# Altium project S7CAS-PLEIADES-CARTE-MERE_P20.PrjPcb (part 3 of 5)

## Sheet S7CAS-PLEIADES-CARTE-MERE_P20_Ethernet.SchDoc
size Tabloid; DocumentNumber: 2; SheetNumber: 12; SheetTotal: 20; Sheet_Name: Ethernet; Size: 11x17
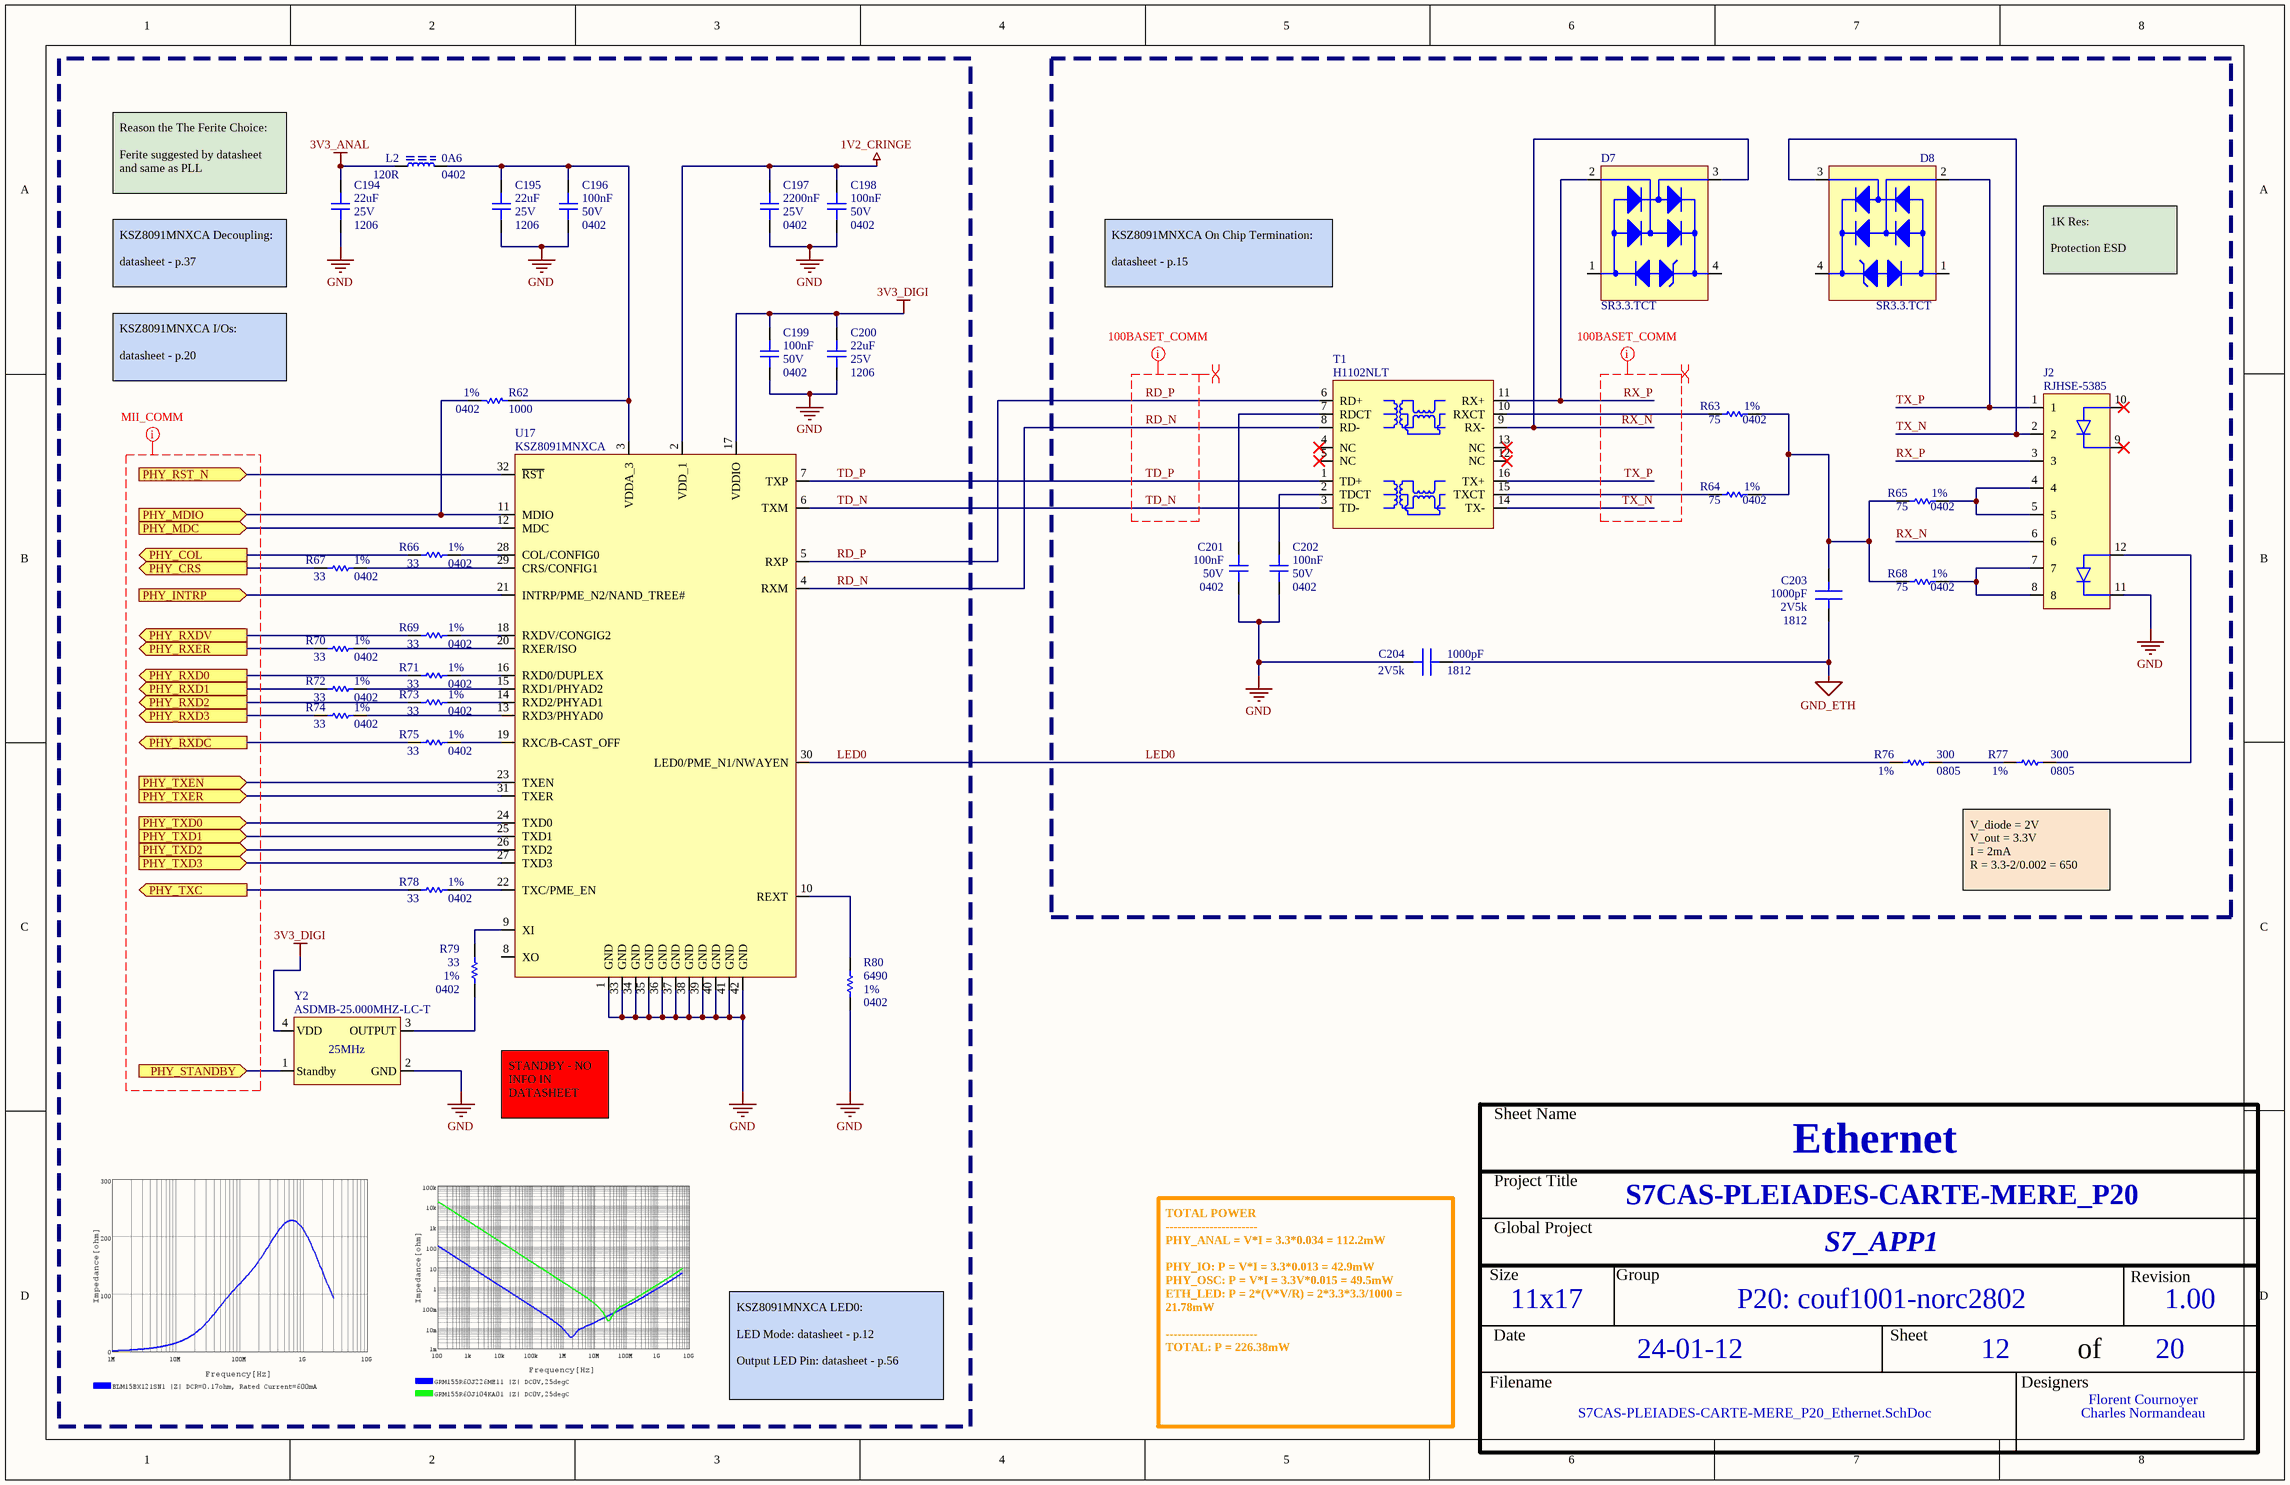
[diagram p11: S7CAS-PLEIADES-CARTE-MERE_P20_Ethernet.SchDoc]

### Parts
C194  value 22uF  Voltage: 25V  Package: 1206  [CAP_1206]  (hidden comment: CAP - 1206)
C195  value 22uF  Voltage: 25V  Package: 1206  [CAP_1206]  (hidden comment: CAP - 1206)
C196  value 100nF  Voltage: 50V  Package: 0402  [CAP_0402]  (hidden comment: CAP - 0402)
C197  value 2200nF  Voltage: 25V  Package: 0402  [CAP_0402]  (hidden comment: CAP - 0402)
C198  value 100nF  Voltage: 50V  Package: 0402  [CAP_0402]  (hidden comment: CAP - 0402)
C199  value 100nF  Voltage: 50V  Package: 0402  [CAP_0402]  (hidden comment: CAP - 0402)
C200  value 22uF  Voltage: 25V  Package: 1206  [CAP_1206]  (hidden comment: CAP - 1206)
C201  value 100nF  Voltage: 50V  Package: 0402  [CAP_0402]  (hidden comment: CAP - 0402)
C202  value 100nF  Voltage: 50V  Package: 0402  [CAP_0402]  (hidden comment: CAP - 0402)
C203  value 1000pF  Package: 1812  Voltage Rating: 2V5k  [CAP_CER_1812]  (hidden comment: 1812WC102KAT1A)
C204  value 1000pF  Package: 1812  Voltage Rating: 2V5k  [CAP_CER_1812]  (hidden comment: 1812WC102KAT1A)
D7  SR3.3.TCT  [TVS_SR3.3.TCT]
D8  SR3.3.TCT  [TVS_SR3.3.TCT]
J2  RJHSE-5385  [CONN_ETHERNET_RJHSE-5385]
L2  value 120R  Current: 0A6  Package: 0402  [FER_0402]  (hidden comment: FER - 0402)
R62  value 1000  Package: 0402  Precision: 1%  [RES_0402]  (hidden comment: RES - 0402)
R63  value 75  Package: 0402  Precision: 1%  [RES_0402]  (hidden comment: RES - 0402)
R64  value 75  Package: 0402  Precision: 1%  [RES_0402]  (hidden comment: RES - 0402)
R65  value 75  Package: 0402  Precision: 1%  [RES_0402]  (hidden comment: RES - 0402)
R66  value 33  Package: 0402  Precision: 1%  [RES_0402]  (hidden comment: RES - 0402)
R67  value 33  Package: 0402  Precision: 1%  [RES_0402]  (hidden comment: RES - 0402)
R68  value 75  Package: 0402  Precision: 1%  [RES_0402]  (hidden comment: RES - 0402)
R69  value 33  Package: 0402  Precision: 1%  [RES_0402]  (hidden comment: RES - 0402)
R70  value 33  Package: 0402  Precision: 1%  [RES_0402]  (hidden comment: RES - 0402)
R71  value 33  Package: 0402  Precision: 1%  [RES_0402]  (hidden comment: RES - 0402)
R72  value 33  Package: 0402  Precision: 1%  [RES_0402]  (hidden comment: RES - 0402)
R73  value 33  Package: 0402  Precision: 1%  [RES_0402]  (hidden comment: RES - 0402)
R74  value 33  Package: 0402  Precision: 1%  [RES_0402]  (hidden comment: RES - 0402)
R75  value 33  Package: 0402  Precision: 1%  [RES_0402]  (hidden comment: RES - 0402)
R76  value 300  Package: 0805  Precision: 1%  [RES_0805]  (hidden comment: RES - 0805)
R77  value 300  Package: 0805  Precision: 1%  [RES_0805]  (hidden comment: RES - 0805)
R78  value 33  Package: 0402  Precision: 1%  [RES_0402]  (hidden comment: RES - 0402)
R79  value 33  Package: 0402  Precision: 1%  [RES_0402]  (hidden comment: RES - 0402)
R80  value 6490  Package: 0402  Precision: 1%  [RES_0402]  (hidden comment: RES - 0402)
T1  H1102NLT  [TRANSFO_H1102NLT]
U17  KSZ8091MNXCA  [COM_ETH_PHY_KSZ8091MNXCA]
Y2  ASDMB-25.000MHZ-LC-T  [OSC_ASDMB-25.000MHZ-LC-T]

### Ports
PHY_COL (out), PHY_CRS (out), PHY_INTRP (in), PHY_MDC (in), PHY_MDIO (in), PHY_RST_N (in), PHY_RXD0 (out), PHY_RXD1 (out), PHY_RXD2 (out), PHY_RXD3 (out), PHY_RXDC (out), PHY_RXDV (out), PHY_RXER (out), PHY_STANDBY (in), PHY_TXC (out), PHY_TXD0 (in), PHY_TXD1 (in), PHY_TXD2 (in), PHY_TXD3 (in), PHY_TXEN (in), PHY_TXER (in)

### Nets
1V2_CRINGE: C197.2 C198.2 U17.2(VDD_1)
3V3_ANAL: C194.2 L2.2
3V3_DIGI: C199.2 C200.2 U17.17(VDDIO) Y2.4(VDD)
GND: C194.1 C195.1 C196.1 C197.1 C198.1 C199.1 C200.1 C201.1 C202.1 C204.2 J2.11(LED2_K) R80.1 U17.1(GND) U17.33(GND) U17.34(GND) U17.35(GND) U17.36(GND) U17.37(GND) U17.38(GND) U17.39(GND) U17.40(GND) U17.41(GND) U17.42(GND) Y2.2(GND)
GND_ETH: C203.2 C204.1
LED0: R76.2 U17.30(LED0/PME_N1/NWAYEN)
PHY_COL: R66.2 ; port PHY_COL
PHY_CRS: R67.2 ; port PHY_CRS
PHY_INTRP: U17.21(INTRP/PME_N2/NAND_TREE#) ; port PHY_INTRP
PHY_MDC: U17.12(MDC) ; port PHY_MDC
PHY_MDIO: R62.1 U17.11(MDIO) ; port PHY_MDIO
PHY_RST_N: U17.32(~{RST}) ; port PHY_RST_N
PHY_RXD0: R71.2 ; port PHY_RXD0
PHY_RXD1: R72.2 ; port PHY_RXD1
PHY_RXD2: R73.2 ; port PHY_RXD2
PHY_RXD3: R74.2 ; port PHY_RXD3
PHY_RXDC: R75.2 ; port PHY_RXDC
PHY_RXDV: R69.2 ; port PHY_RXDV
PHY_RXER: R70.2 ; port PHY_RXER
PHY_STANDBY: Y2.1(Standby) ; port PHY_STANDBY
PHY_TXC: R78.2 ; port PHY_TXC
PHY_TXD0: U17.24(TXD0) ; port PHY_TXD0
PHY_TXD1: U17.25(TXD1) ; port PHY_TXD1
PHY_TXD2: U17.26(TXD2) ; port PHY_TXD2
PHY_TXD3: U17.27(TXD3) ; port PHY_TXD3
PHY_TXEN: U17.23(TXEN) ; port PHY_TXEN
PHY_TXER: U17.31(TXER) ; port PHY_TXER
RD_N: T1.8(RD-) U17.4(RXM)
RD_P: T1.6(RD+) U17.5(RXP)
RX_N: D7.3 J2.6 T1.9(RX-)
RX_P: D7.2(VN) J2.3 T1.11(RX+)
TD_N: T1.3(TD-) U17.6(TXM)
TD_P: T1.1(TD+) U17.7(TXP)
TX_N: D8.3 J2.2 T1.14(TX-)
TX_P: D8.2(VN) J2.1 T1.16(TX+)
NetC195_2: C195.2 C196.2 L2.1 R62.2 U17.3(VDDA_3)
NetC201_2: C201.2 T1.7(RDCT)
NetC202_2: C202.2 T1.2(TDCT)
NetC203_1: C203.1 R63.1 R64.1 R65.2 R68.2
NetJ2_4: J2.4 J2.5 R65.1
NetJ2_7: J2.7 J2.8 R68.1
NetJ2_12: J2.12(LED2_A) R77.1
NetR63_2: R63.2 T1.10(RXCT)
NetR64_2: R64.2 T1.15(TXCT)
NetR66_1: R66.1 U17.28(COL/CONFIG0)
NetR67_1: R67.1 U17.29(CRS/CONFIG1)
NetR69_1: R69.1 U17.18(RXDV/CONGIG2)
NetR70_1: R70.1 U17.20(RXER/ISO)
NetR71_1: R71.1 U17.16(RXD0/DUPLEX)
NetR72_1: R72.1 U17.15(RXD1/PHYAD2)
NetR73_1: R73.1 U17.14(RXD2/PHYAD1)
NetR74_1: R74.1 U17.13(RXD3/PHYAD0)
NetR75_1: R75.1 U17.19(RXC/B-CAST_OFF)
NetR76_1: R76.1 R77.2
NetR78_1: R78.1 U17.22(TXC/PME_EN)
NetR79_1: R79.1 U17.9(XI)
NetR79_2: R79.2 Y2.3(OUTPUT)
NetR80_2: R80.2 U17.10(REXT)

Not connected (* = marked no-connect by the designer): D7 1(I/O) 4; D8 1(I/O) 4; J2 9(LED1_K)* 10(LED1_A)*; T1 4(NC)* 5(NC)* 12(NC)* 13(NC)*; U17 8(XO)

### Layout directives
net class MII_COMM; net class TRACKS_50: (no net found under the mark)
net class TRACKS_50: RD_N, RD_P, RX_N, RX_P, TD_N, TD_P, TX_N, TX_P
differential pair: RD_N, RD_P, RX_N, RX_P, TD_N, TD_P, TX_N, TX_P

### Notes on the sheet
- Reason the The Ferite Choice:
  Ferite suggested by datasheet and same as PLL
- KSZ8091MNXCA Decoupling:
  datasheet - p.37
- KSZ8091MNXCA On Chip Termination:
  datasheet - p.15
- 1K Res:
  Protection ESD
- KSZ8091MNXCA I/Os:
  datasheet - p.20
- V_diode = 2V
  V_out = 3.3V
  I = 2mA
  R = 3.3-2/0.002 = 650
- STANDBY - NO INFO IN DATASHEET
- KSZ8091MNXCA LED0:
  LED Mode: datasheet - p.12
  Output LED Pin: datasheet - p.56
- TOTAL POWER
  -----------------------
  PHY_ANAL = V*I = 3.3*0.034 = 112.2mW
  PHY_IO: P = V*I = 3.3*0.013 = 42.9mW
  PHY_OSC: P = V*I = 3.3V*0.015 = 49.5mW
  ETH_LED: P = 2*(V*V/R) = 2*3.3*3.3/1000 = 21.78mW
  -----------------------
  TOTAL: P = 226.38mW
- Sheet Name
- Project Title
- Global Project
- Size
- Group
- Revision
- Date
- Sheet
- of
- Filename
- Designers

### Library data of the parts
C194 C195 C200 = CAP - 1206: Mfg Part Number: GRM31CC81E226KE11; Precision: 10%; Current: *; HelpURL: https://search.murata.co.jp/Ceramy/image/img/A01X/G101/ENG/GRM31CD71H106KE11-01A.pdf; CreatedBy: Jonathan Bouchard; Power: *
C196 C198 C199 C201 C202 = CAP - 0402: Mfg Part Number: GRM155R61H104KE14; Precision: 10%; Current: *; CreatedBy: Jonathan Bouchard; Power: *
C197 = CAP - 0402: Mfg Part Number: GRM155R61E225KE11; Precision: 10%; Current: *; CreatedBy: Jonathan Bouchard; Power: *
C203 C204 = CAP_CER_1812WC102KAT1A: CAP - CER 1000PF 2.5KV X7R - 1812; Tolerance: 10%; GRAMS Lib Spec: 2.7; Temperature: -55 to 125C
D7 D8 = TVS_SR3.3.TCT: TVS - DIODE ARRAY 3.3V 150W - SOT143-4; Mfg: Semtech; Voltage: VBR=3.3V; Current: *; Mfg Part Number: SR3.3.TCT; HelpURL: http://www.semtech.com/images/datasheet/sr3.3.pdf; CreatedBy: Jonathan Bouchard; Temperature: -55°C to 125°C; Power: 150W; Package: SOT143-4; Precision: *; Value: *; Supplier 1: Digikey; Supplier Part Number 1: SR3.3DKR-ND
J2 = CONN_ETHERNET_RJHSE-5385: CONN - MOD JACK RJ45 R/A ETHERNET - TH; Mfg: Amphenol; Voltage: *; Current: *; Power: *; Mfg Part Number: RJHSE-5385; HelpURL: https://www.amphenolcanada.com/ProductSearch/drawings/AC/RJHSE538X.pdf; CreatedBy: Jonathan Bouchard; Temperature: -55°C ~ 85°C; Value: *; Precision: *; Package: TH-12; Supplier 1: Digikey; Supplier Part Number 1: RJHSE-5385-ND
L2 = FER - 0402: Mfg Part Number: BLM15BX121SN1; Voltage: *; CreatedBy: Jonathan Bouchard; Power: *; Precision: *
R62 = RES - 0402: Mfg Part Number: MCS04020C1001FE000; Voltage: 50V; Power: 1/16W; Current: *; CreatedBy: Jonathan Bouchard
R63-R65 R68 = RES - 0402: Mfg Part Number: SG73P; Voltage: 50V; Power: 1/16W; Current: *; CreatedBy: Jonathan Bouchard
R66 R67 R69-R75 R78 R79 = RES - 0402: Mfg Part Number: CRCW040233R0FKEDC; Voltage: 50V; Power: 1/16W; Current: *; CreatedBy: Jonathan Bouchard
R76 R77 = RES - 0805: Mfg Part Number: CRM0805-FX-1000ELF; Current: *; CreatedBy: Jonathan Bouchard
R80 = RES - 0402: Mfg Part Number: CRCW04026K49FKEDC; Voltage: 50V; Power: 1/16W; Current: *; CreatedBy: Jonathan Bouchard
T1 = TRANSFO_H1102NLT: TRANSFO - ETHERNET 10/100B-TX - SMD-16; Mfg: Pulse Eng.; Value: 1:1 (350uH); Voltage: *; Current: *; Power: *; Mfg Part Number: H1102NLT; HelpURL: http://media.digikey.com/pdf/Data%20Sheets/Pulse%20PDFs/10_100BASE-T%20Single%20Port%20SMD%20Magnetics_Rev2008.pdf; CreatedBy: Jonathan Bouchard; Temperature: -40°C to 85°C; Precision: *; Package: SMD-16; Supplier 1: Digikey; Supplier Part Number 1: 553-1532-1-ND
U17 = COM_ETH_PHY_KSZ8091MNXCA: COM - ETHERNET PHY 10/100 - QFN-32; Voltage: 1.8V, 2.5V, 3.3V; Mfg: Micrel; Current: *; Power: *; Mfg Part Number: KSZ8091MNXCA; HelpURL: http://ww1.microchip.com/downloads/en/DeviceDoc/00002275A.pdf; CreatedBy: Jonathan Bouchard; Temperature: 0°C ~ 70°C; Value: *; Precision: *; Package: QFN-32; Supplier 1: Digikey; Supplier Part Number 1: 576-4356-ND
Y2 = OSC_ASDMB-25.000MHZ-LC-T: OSC - 25MHz XO (Standard) LVCMOS - 4-SMD, No Lead; Manufacturer #1: Abracon LLC; Tolerance: ±50ppm; Voltage Rating: 1.8V ~ 3.3V; GRAMS Lib Spec: 2.8; Magnetic Material: Unknown; Polarized: Yes; Value: 25MHz; Current Rating: *; Power Max: *; HelpURL: https://abracon.com/Oscillators/ASDMB.pdf; CreatedBy/Date: Joël Lemay 2019-03-29; VerifiedBy: C. Paulin - 29 mai 2019; Temperature: -40°C ~ +85°C; Package: 4-SMD, No Lead; Manufacturer #2: *; Note: *; Assembly Type: SMD; Part Number #2: *; Part Number #1: ASDMB-25.000MHZ-LC-T; Supplier 1: Digi-Key; Supplier Part Number 1: 535-11730-1-ND; Cryo: UNKNOWN; Mfg PArt Number: ASDMB-25.000MHZ-LC-T

## Sheet S7CAS-PLEIADES-CARTE-MERE_P20_USB.SchDoc
size Tabloid; SheetNumber: 13; SheetTotal: 20; Sheet_Name: USB; Size: 11x17
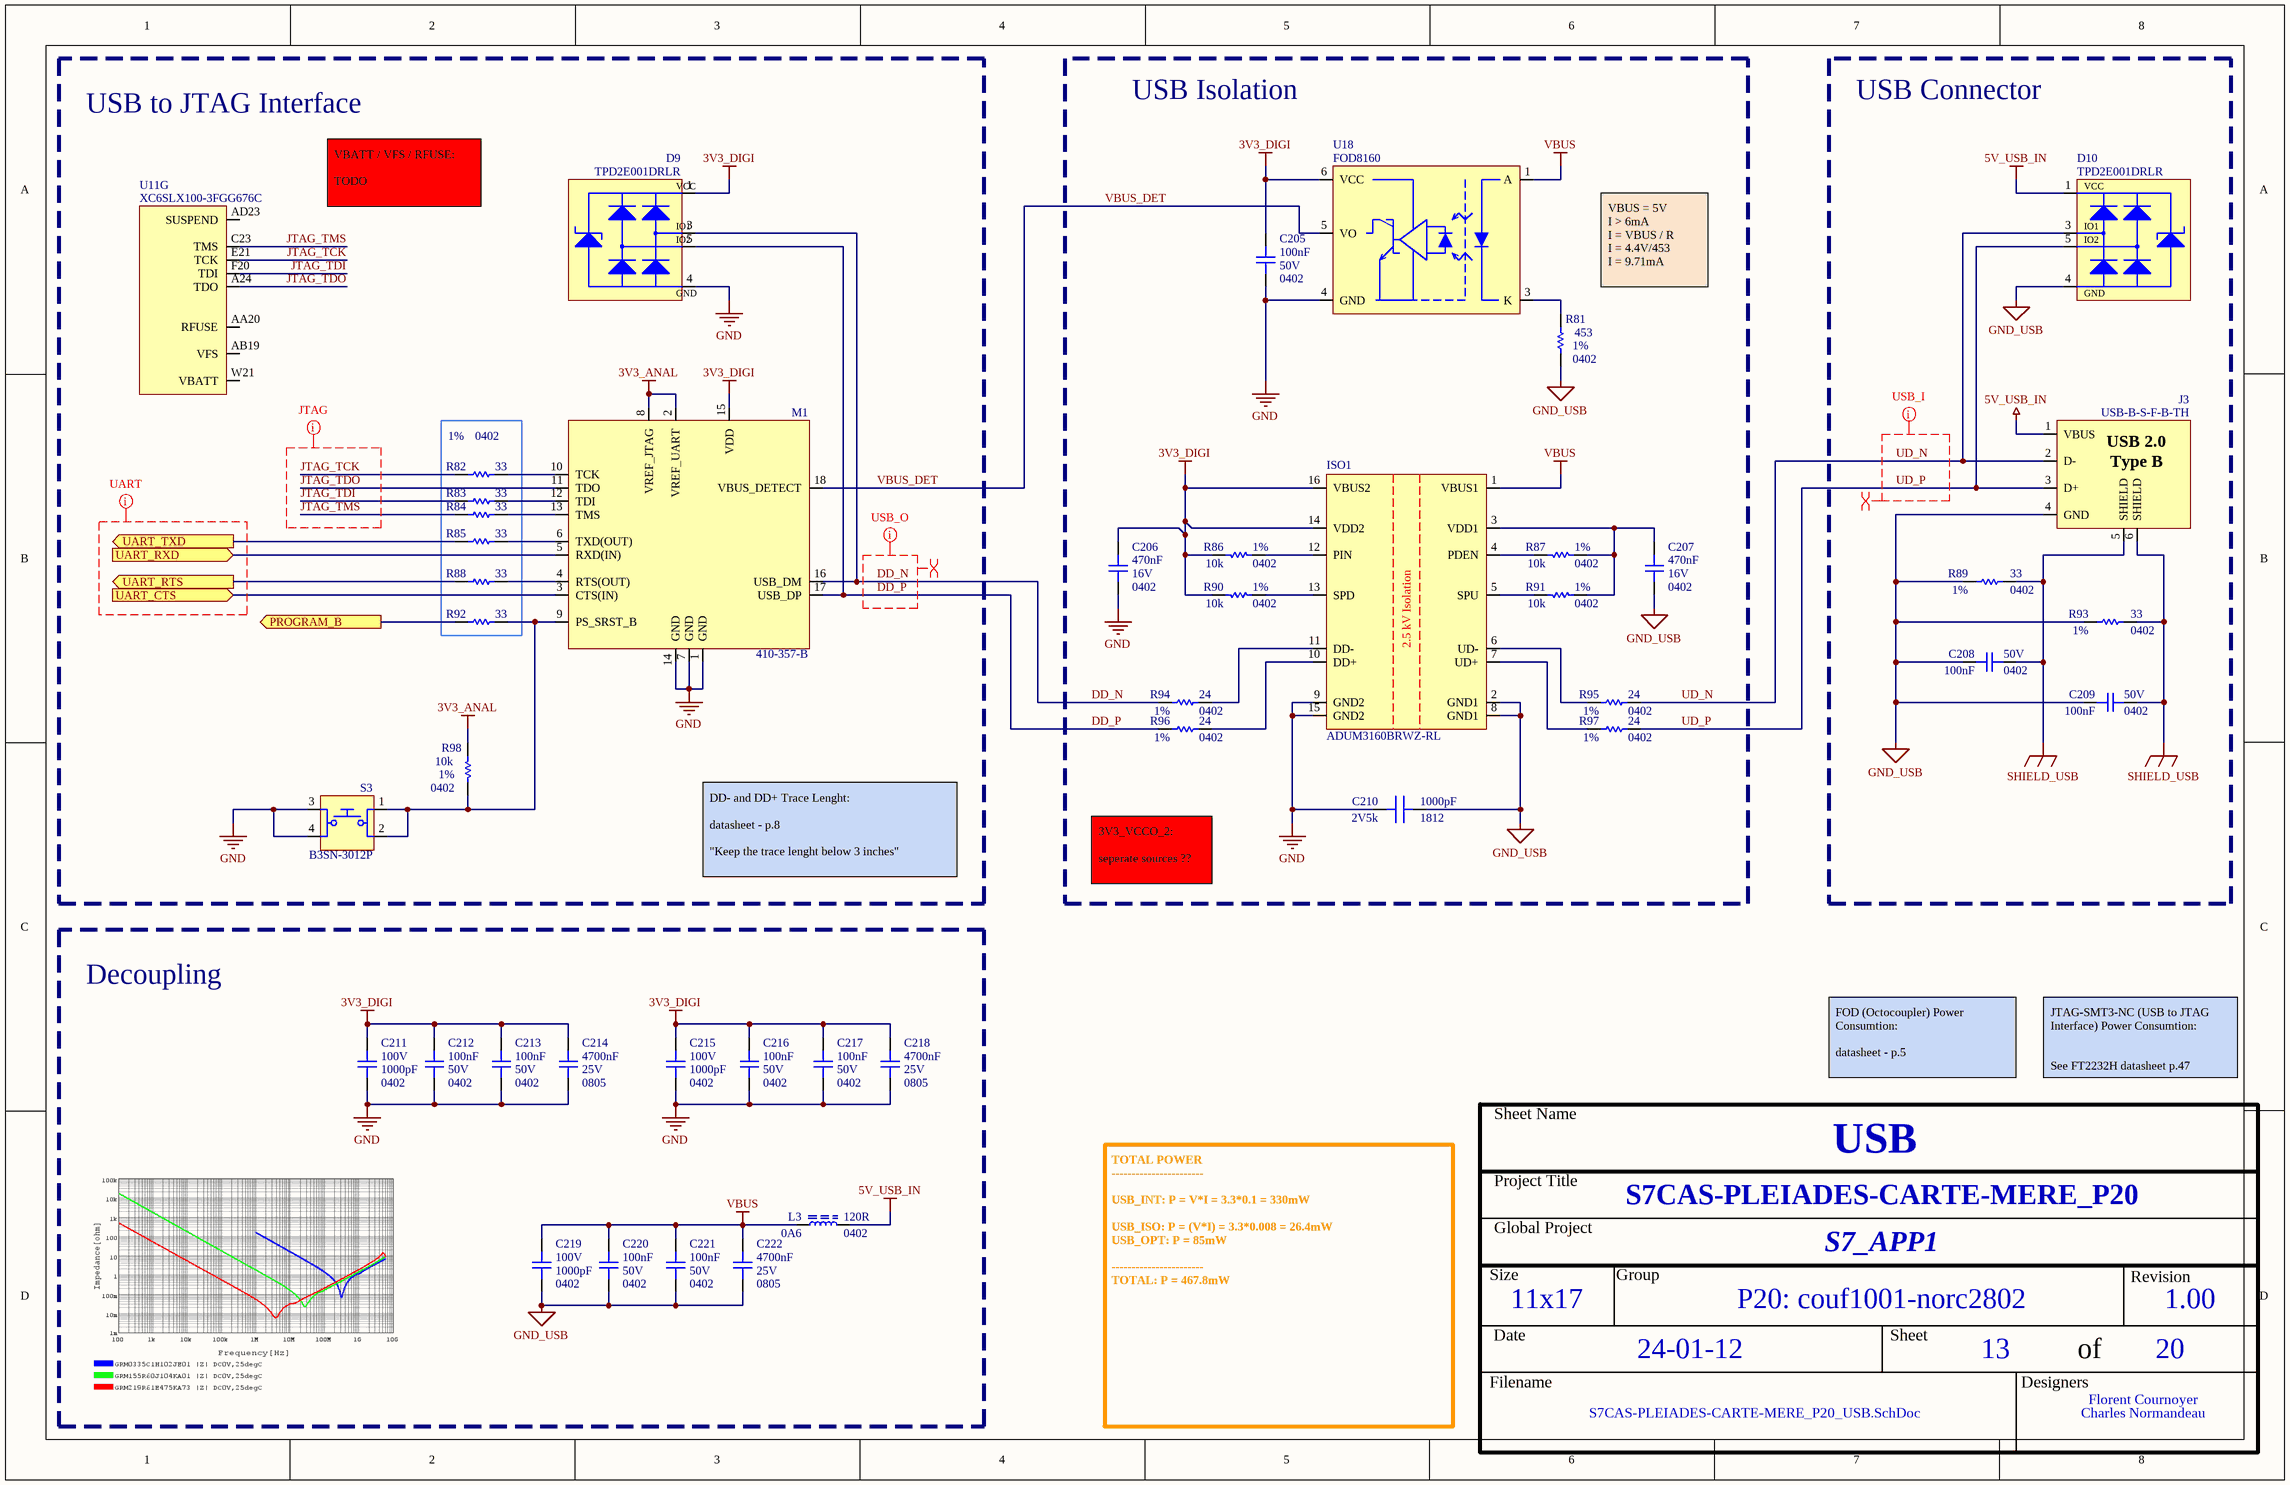
[diagram p12: S7CAS-PLEIADES-CARTE-MERE_P20_USB.SchDoc]

### Parts
C205  value 100nF  Voltage: 50V  Package: 0402  [CAP_0402]  (hidden comment: CAP - 0402)
C206  value 470nF  Voltage: 16V  Package: 0402  [CAP_0402]  (hidden comment: CAP - 0402)
C207  value 470nF  Voltage: 16V  Package: 0402  [CAP_0402]  (hidden comment: CAP - 0402)
C208  value 100nF  Voltage: 50V  Package: 0402  [CAP_0402]  (hidden comment: CAP - 0402)
C209  value 100nF  Voltage: 50V  Package: 0402  [CAP_0402]  (hidden comment: CAP - 0402)
C210  value 1000pF  Package: 1812  Voltage Rating: 2V5k  [CAP_CER_1812]  (hidden comment: 1812WC102KAT1A)
C211  value 1000pF  Voltage: 100V  Package: 0402  [CAP_0402]  (hidden comment: CAP - 0402)
C212  value 100nF  Voltage: 50V  Package: 0402  [CAP_0402]  (hidden comment: CAP - 0402)
C213  value 100nF  Voltage: 50V  Package: 0402  [CAP_0402]  (hidden comment: CAP - 0402)
C214  value 4700nF  Voltage: 25V  Package: 0805  [CAP_0805]  (hidden comment: CAP - 0805)
C215  value 1000pF  Voltage: 100V  Package: 0402  [CAP_0402]  (hidden comment: CAP - 0402)
C216  value 100nF  Voltage: 50V  Package: 0402  [CAP_0402]  (hidden comment: CAP - 0402)
C217  value 100nF  Voltage: 50V  Package: 0402  [CAP_0402]  (hidden comment: CAP - 0402)
C218  value 4700nF  Voltage: 25V  Package: 0805  [CAP_0805]  (hidden comment: CAP - 0805)
C219  value 1000pF  Voltage: 100V  Package: 0402  [CAP_0402]  (hidden comment: CAP - 0402)
C220  value 100nF  Voltage: 50V  Package: 0402  [CAP_0402]  (hidden comment: CAP - 0402)
C221  value 100nF  Voltage: 50V  Package: 0402  [CAP_0402]  (hidden comment: CAP - 0402)
C222  value 4700nF  Voltage: 25V  Package: 0805  [CAP_0805]  (hidden comment: CAP - 0805)
D9  TPD2E001DRLR  [TVS_USB_TPD2E001DRLR]
D10  TPD2E001DRLR  [TVS_USB_TPD2E001DRLR]
ISO1  ADUM3160BRWZ-RL  [ISO_ADUM3160BRWZ-RL]
J3  USB-B-S-F-B-TH  [CON_USB_USB-B-S-F-B-TH]
L3  value 120R  Current: 0A6  Package: 0402  [FER_0402]  (hidden comment: FER - 0402)
M1  410-357-B  [MOD_JTAG_410-357-B]
R81  value 453  Package: 0402  Precision: 1%  [RES_0402]  (hidden comment: RES - 0402)
R82  value 33  Package: 0402  Precision: 1%  [RES_0402]  (hidden comment: RES - 0402)
R83  value 33  [RES_0402]  (hidden comment: RES - 0402)
R84  value 33  [RES_0402]  (hidden comment: RES - 0402)
R85  value 33  [RES_0402]  (hidden comment: RES - 0402)
R86  value 10k  Package: 0402  Precision: 1%  [RES_0402]  (hidden comment: RES - 0402)
R87  value 10k  Package: 0402  Precision: 1%  [RES_0402]  (hidden comment: RES - 0402)
R88  value 33  [RES_0402]  (hidden comment: RES - 0402)
R89  value 33  Package: 0402  Precision: 1%  [RES_0402]  (hidden comment: RES - 0402)
R90  value 10k  Package: 0402  Precision: 1%  [RES_0402]  (hidden comment: RES - 0402)
R91  value 10k  Package: 0402  Precision: 1%  [RES_0402]  (hidden comment: RES - 0402)
R92  value 33  [RES_0402]  (hidden comment: RES - 0402)
R93  value 33  Package: 0402  Precision: 1%  [RES_0402]  (hidden comment: RES - 0402)
R94  value 24  Package: 0402  Precision: 1%  [RES_0402]  (hidden comment: RES - 0402)
R95  value 24  Package: 0402  Precision: 1%  [RES_0402]  (hidden comment: RES - 0402)
R96  value 24  Package: 0402  Precision: 1%  [RES_0402]  (hidden comment: RES - 0402)
R97  value 24  Package: 0402  Precision: 1%  [RES_0402]  (hidden comment: RES - 0402)
R98  value 10k  Package: 0402  Precision: 1%  [RES_0402]  (hidden comment: RES - 0402)
S3  B3SN-3012P  [SWI_TACT_B3SN-3012P]
U11  XC6SLX100-3FGG676C  [FPGA_XILINX_FGG676]  (part G of 10)
U18  FOD8160  [FOD8160]

### Blocks framed on the sheet
USB to JTAG Interface: D9 M1 R82-R85 R88 R92 R98 S3 U11
USB Isolation: C205-C207 C210 ISO1 R81 R86 R87 R90 R91 R94-R97 U18
USB Connector: C208 C209 D10 J3 R89 R93
Decoupling: C211-C222 L3

### Ports
PROGRAM_B (out), UART_CTS (in), UART_RTS (out), UART_RXD (in), UART_TXD (out)

### Nets
3V3_ANAL: M1.2(VREF_UART) M1.8(VREF_JTAG) R98.2
3V3_DIGI: C205.2 C206.2 C211.1 C212.2 C213.2 C214.2 C215.1 C216.2 C217.2 C218.2 D9.1(VCC) ISO1.14(VDD2) ISO1.16(VBUS2) M1.15(VDD) R86.2 R90.2 U18.6(VCC)
5V_USB_IN: D10.1(VCC) J3.1(VBUS) L3.1
GND: C205.1 C206.1 C210.2 C211.2 C212.1 C213.1 C214.1 C215.2 C216.1 C217.1 C218.1 D9.4(GND) ISO1.9(GND2) ISO1.15(GND2) M1.1(GND) M1.7(GND) M1.14(GND) S3.3 S3.4 U18.4(GND)
GND_USB: C207.1 C208.2 C209.2 C210.1 C219.2 C220.1 C221.1 C222.1 D10.4(GND) ISO1.2(GND1) ISO1.8(GND1) J3.4(GND) R81.1 R89.2 R93.2
SHIELD_USB: C208.1 C209.1 J3.5(SHIELD) J3.6(SHIELD) R89.1 R93.1
VBUS: C219.1 C220.2 C221.2 C222.2 ISO1.1(VBUS1) L3.2 U18.1(A)
DD_N: D9.3(IO1) M1.16(USB_DM) R94.2
DD_P: D9.5(IO2) M1.17(USB_DP) R96.2
JTAG_TCK: R82.2 U11.E21(TCK)
JTAG_TDI: R83.2 U11.F20(TDI)
JTAG_TDO: M1.11(TDO) U11.A24(TDO)
JTAG_TMS: R84.2 U11.C23(TMS)
PROGRAM_B: R92.2 ; port PROGRAM_B
UART_CTS: M1.3(CTS(IN)) ; port UART_CTS
UART_RTS: R88.2 ; port UART_RTS
UART_RXD: M1.5(RXD(IN)) ; port UART_RXD
UART_TXD: R85.2 ; port UART_TXD
UD_N: D10.3(IO1) J3.2(D-) R95.1
UD_P: D10.5(IO2) J3.3(D+) R97.1
VBUS_DET: M1.18(VBUS_DETECT) U18.5(VO)
NetC207_2: C207.2 ISO1.3(VDD1) R87.1 R91.1
NetISO1_4: ISO1.4(PDEN) R87.2
NetISO1_5: ISO1.5(SPU) R91.2
NetISO1_6: ISO1.6(UD-) R95.2
NetISO1_7: ISO1.7(UD+) R97.2
NetISO1_10: ISO1.10(DD+) R96.1
NetISO1_11: ISO1.11(DD-) R94.1
NetISO1_12: ISO1.12(PIN) R86.1
NetISO1_13: ISO1.13(SPD) R90.1
NetM1_4: M1.4(RTS(OUT)) R88.1
NetM1_6: M1.6(TXD(OUT)) R85.1
NetM1_9: M1.9(PS_SRST_B) R92.1 R98.1 S3.1 S3.2
NetM1_10: M1.10(TCK) R82.1
NetM1_12: M1.12(TDI) R83.1
NetM1_13: M1.13(TMS) R84.1
NetR81_2: R81.2 U18.3(K)

Not connected (* = marked no-connect by the designer): D9 2(NC); D10 2(NC); U11 AA20(RFUSE) AB19(VFS) AD23(SUSPEND) W21(VBATT)

### Layout directives
net class TRACKS_50: (no net found under the mark), DD_N, DD_P, JTAG_TCK, JTAG_TDI, JTAG_TDO, JTAG_TMS, UD_N, UD_P
differential pair: DD_N, DD_P, UD_N, UD_P

### Notes on the sheet
- VBATT / VFS / RFUSE:
  TODO
- VBUS = 5V
  I > 6mA
  I = VBUS / R
  I = 4.4V/453
  I = 9.71mA
- DD- and DD+ Trace Lenght:
  datasheet - p.8
  "Keep the trace lenght below 3 inches"
- 3V3_VCCO_2:
  seperate sources ??
- FOD (Octocoupler) Power Consumtion:
  datasheet - p.5
- JTAG-SMT3-NC (USB to JTAG Interface) Power Consumtion:
  See FT2232H datasheet p.47
  (https://ftdichip.com/wp-content/uploads/2020/08/DS_FT2232H.pdf)
- TOTAL POWER
  -----------------------
  USB_INT: P = V*I = 3.3*0.1 = 330mW
  USB_ISO: P = (V*I) = 3.3*0.008 = 26.4mW
  USB_OPT: P = 85mW
  -----------------------
  TOTAL: P = 467.8mW
- Sheet Name
- Project Title
- Global Project
- Size
- Group
- Revision
- Date
- Sheet
- of
- Filename
- Designers
- (in symbol CON_USB_USB-B-S-F-B-TH) USB 2.0; Type B
- (in symbol ISO_ADUM3160BRWZ-RL) 2.5 kV Isolation

### Library data of the parts
C205 C208 C209 C212 C213 C216 C217 C220 C221 = CAP - 0402: as C196 on sheet S7CAS-PLEIADES-CARTE-MERE_P20_Ethernet; Current: *; CreatedBy: Jonathan Bouchard; Power: *
C206 C207 = CAP - 0402: as C130-C139 on sheet S7CAS-PLEIADES-CARTE-MERE_P20_FPGA-Decoupling; Current: *; CreatedBy: Jonathan Bouchard; Power: *
C210 = CAP_CER_1812WC102KAT1A: as C203 on sheet S7CAS-PLEIADES-CARTE-MERE_P20_Ethernet; Temperature: -55 to 125C
C211 C215 C219 = CAP - 0402: Mfg Part Number: GRM155R72A102KA01; Precision: 10%; Current: *; CreatedBy: Jonathan Bouchard; Power: *
C214 C218 C222 = CAP - 0805: as C125-C129 on sheet S7CAS-PLEIADES-CARTE-MERE_P20_FPGA-Decoupling; Current: *; CreatedBy: Jonathan Bouchard; Power: *
D9 D10 = TVS_USB_TPD2E001DRLR: TVS - USB TVS DIODE 5.5V - SOT-553; Manufacturer #1: Texas Instruments; Value: 11V Breakdown; Voltage Rating: 5.5V (Max); GRAMS Lib Spec: 2.8; Magnetic Material: YES; Cryo: UNKNOWN; Tolerance: *; Current Rating: *; Power Max: *; HelpURL: http://www.ti.com/lit/ds/symlink/tpd2e001.pdf; CreatedBy/Date: Jonathan Bouchard 2018-07-10; VerifiedBy: Arnaud Samson 16-07-18; Temperature: -40°C ~ 85°C (TA); Package: SOT-553; Manufacturer #2: *; Note: *; Assembly Type: SMD; Part Number #2: *; Part Number #1: TPD2E001DRLR; Polarized: YES; Supplier 1: Digi-Key; Supplier Part Number 1: 296-21883-1-ND; Mfg Part Number: TPD2E001DRLR
ISO1 = ISO_ADUM3160BRWZ-RL: ISO - DGTL ISO 2.5KV 2CH USB - 16SOIC; Manufacturer #1: Analog Devices; Value: 2500Vrms voltage isolation; Voltage Rating: 3~5.5V; GRAMS Lib Spec: 2.8; Magnetic Material: UNKNOWN; Polarized: Yes; Tolerance: *; Current Rating: *; Power Max: *; HelpURL: https://www.analog.com/media/en/technical-documentation/data-sheets/ADuM3160.pdf; CreatedBy/Date: Tommy Rossignol 2018-11-16; VerifiedBy: Caroline Paulin - 13 février 2019; Temperature: -40°C ~ 105°C; Package: 16-SOIC; Manufacturer #2: *; Assembly Type: SMD; Part Number #2: *; Part Number #1: ADUM3160BRWZ-RL; Supplier 1: Digi-Key; Supplier Part Number 1: ADUM3160BRWZ-RLCT-ND; Cryo: UNKNOWN; Mfg Part Number: ADUM3160BRWZ-RL
J3 = CON_USB_USB-B-S-F-B-TH: CON - USB B RECPT TH R/A - 4-TH; Manufacturer #1: Samtec Inc.; Value: USB B; Voltage Rating: 30VAC; GRAMS Lib Spec: 2.8c; Magnetic Material: UNKNOWN; Polarized: YES; Tolerance: *; Current Rating: *; Power Max: *; HelpURL: http://suddendocs.samtec.com/catalog_english/usb_b.pdf; CreatedBy/Date: Jonathan Bouchard 2020-03-24; VerifiedBy: C.Paulin - 22/04/2020; Temperature: -50°C ~ 85°C; Package: 4-TH; Manufacturer #2: *; Note: *; Assembly Type: TH; Part Number #2: *; Part Number #1: USB-B-S-F-B-TH; Supplier 1: Digi-Key; Supplier Part Number 1: SAM10867-ND; Cryo: UNKNOWN; Mfg Part Number: CON_USB_USB-B-S-F-B-TH
L3 = FER - 0402: Mfg Part Number: BLM15BX121SN1; Voltage: *; CreatedBy: Jonathan Bouchard; Power: *; Precision: *
M1 = MOD_JTAG_410-357-B: MOD - JTAG-SMT3-NC Programming Module For Xilinx FPGA - 18-SMT; Manufacturer #1: Digilent; Voltage Rating: VDD: 2.97V~3.63V, VJTAG/VUART: 1.65V~5.5V; GRAMS Lib Spec: 2.8; Note: Prior to reflow, the JTAG-SMT3-NC module must be dried at 125°C for 17 hours; Magnetic Material: Unknown; Polarized: Yes; Value: *; Tolerance: *; Current Rating: *; Power Max: *; HelpURL: https://reference.digilentinc.com/_media/reference/programmers/jtag-smt3/jtag-smt3-nc_rm.pdf; CreatedBy/Date: Tommy Rossignol 2018-11-23; VerifiedBy: Nicolas V. (2019-01-28); Temperature: -40°C ~ 85°C; Package: 18-pad SMT; Manufacturer #2: *; Assembly Type: SMD; Part Number #2: *; Part Number #1: 410-357-B; Supplier 1: Digi-Key; Supplier Part Number 1: 1286-1196-ND; Cryo: UNKNOWN
R81 = RES - 0402: Mfg Part Number: RGC1/16SC6980FTH; Voltage: 50V; Power: 1/16W; Current: *; CreatedBy: Jonathan Bouchard
R82 R89 R93 = RES - 0402: Voltage: 50V; Power: 1/16W; Current: *; CreatedBy: Jonathan Bouchard
R83-R85 R88 R92 = RES - 0402: Voltage: 50V; Power: 1/16W; Precision: 1%; Current: *; CreatedBy: Jonathan Bouchard; Package: 0402
R86 R87 R90 R91 R98 = RES - 0402: Mfg Part Number: MCS04020C1002FE000; Voltage: 50V; Power: 1/16W; Current: *; CreatedBy: Jonathan Bouchard
R94-R97 = RES - 0402: Mfg Part Number: MCS04020C2409FE000; Voltage: 50V; Power: 1/16W; Current: *; CreatedBy: Jonathan Bouchard
S3 = SWI_TACT_B3SN-3012P_1: SWI - SWITCH TACTILE SPST-NO 0.05A 24V -SMD; Manufacturer #1: Omron Electronics Inc-EMC Div; Current Rating: 50mA; Voltage rating: 24VDC; Polarized: No; Magnetic Material: UNKNOWN; GRAMS Lib Spec: 2.8; Manufacturer #2: *; Power Max: *; Value: SPST-NO; Part Number #1: B3SN-3012P; Part Number #2: *; HelpURL: http://omronfs.omron.com/en_US/ecb/products/pdf/en-b3sn.pdf; Supplier 1: Digi-Key; Supplier Part Number 1: SW261CT-ND; Assembly Type: SMD; Temperature: -25°C ~ 70°C; Package: SMD; CreatedBy/Date: Olivier Bernard / 5/12/2017; Tolerance: *; VerifiedBy: Caroline Paulin / 11 juillet 2018; Cryo: UNKNOWN; Mfg Part Number: B3SN-3012P
U11 = FPGA_XC6SLX100-3FGG676C: FPGA - XILINX SPARTAN 6 480 I/O - BGA-676; Voltage: 1.14 V ~ 1.26 V; Current: *; Power: *; Mfg: Xilinx; Mfg Part Number: XC6SLX100-3FGG676C; HelpURL: https://www.xilinx.com/support/documentation/data_sheets/ds162.pdf; CreatedBy: Jonathan Bouchard; Temperature: 0°C ~ 85°C (TJ); Value: *; Precision: *; Package: BGA-676; Supplier 1: Digikey; Supplier Part Number 1: 122-1760-ND
U18 = OCTOCOUPLER_FOD8160: XXX - Description - Package; GRAMS Lib Spec: 2.7; HelpURL: https://www.onsemi.com/pdf/datasheet/fod8160-d.pdf; Mfg Part Number: FOD8160

## Sheet S7CAS-PLEIADES-CARTE-MERE_P20_PLL.SchDoc
size Tabloid; SheetNumber: 14; SheetTotal: 20; Sheet_Name: PLL; Size: 11x17
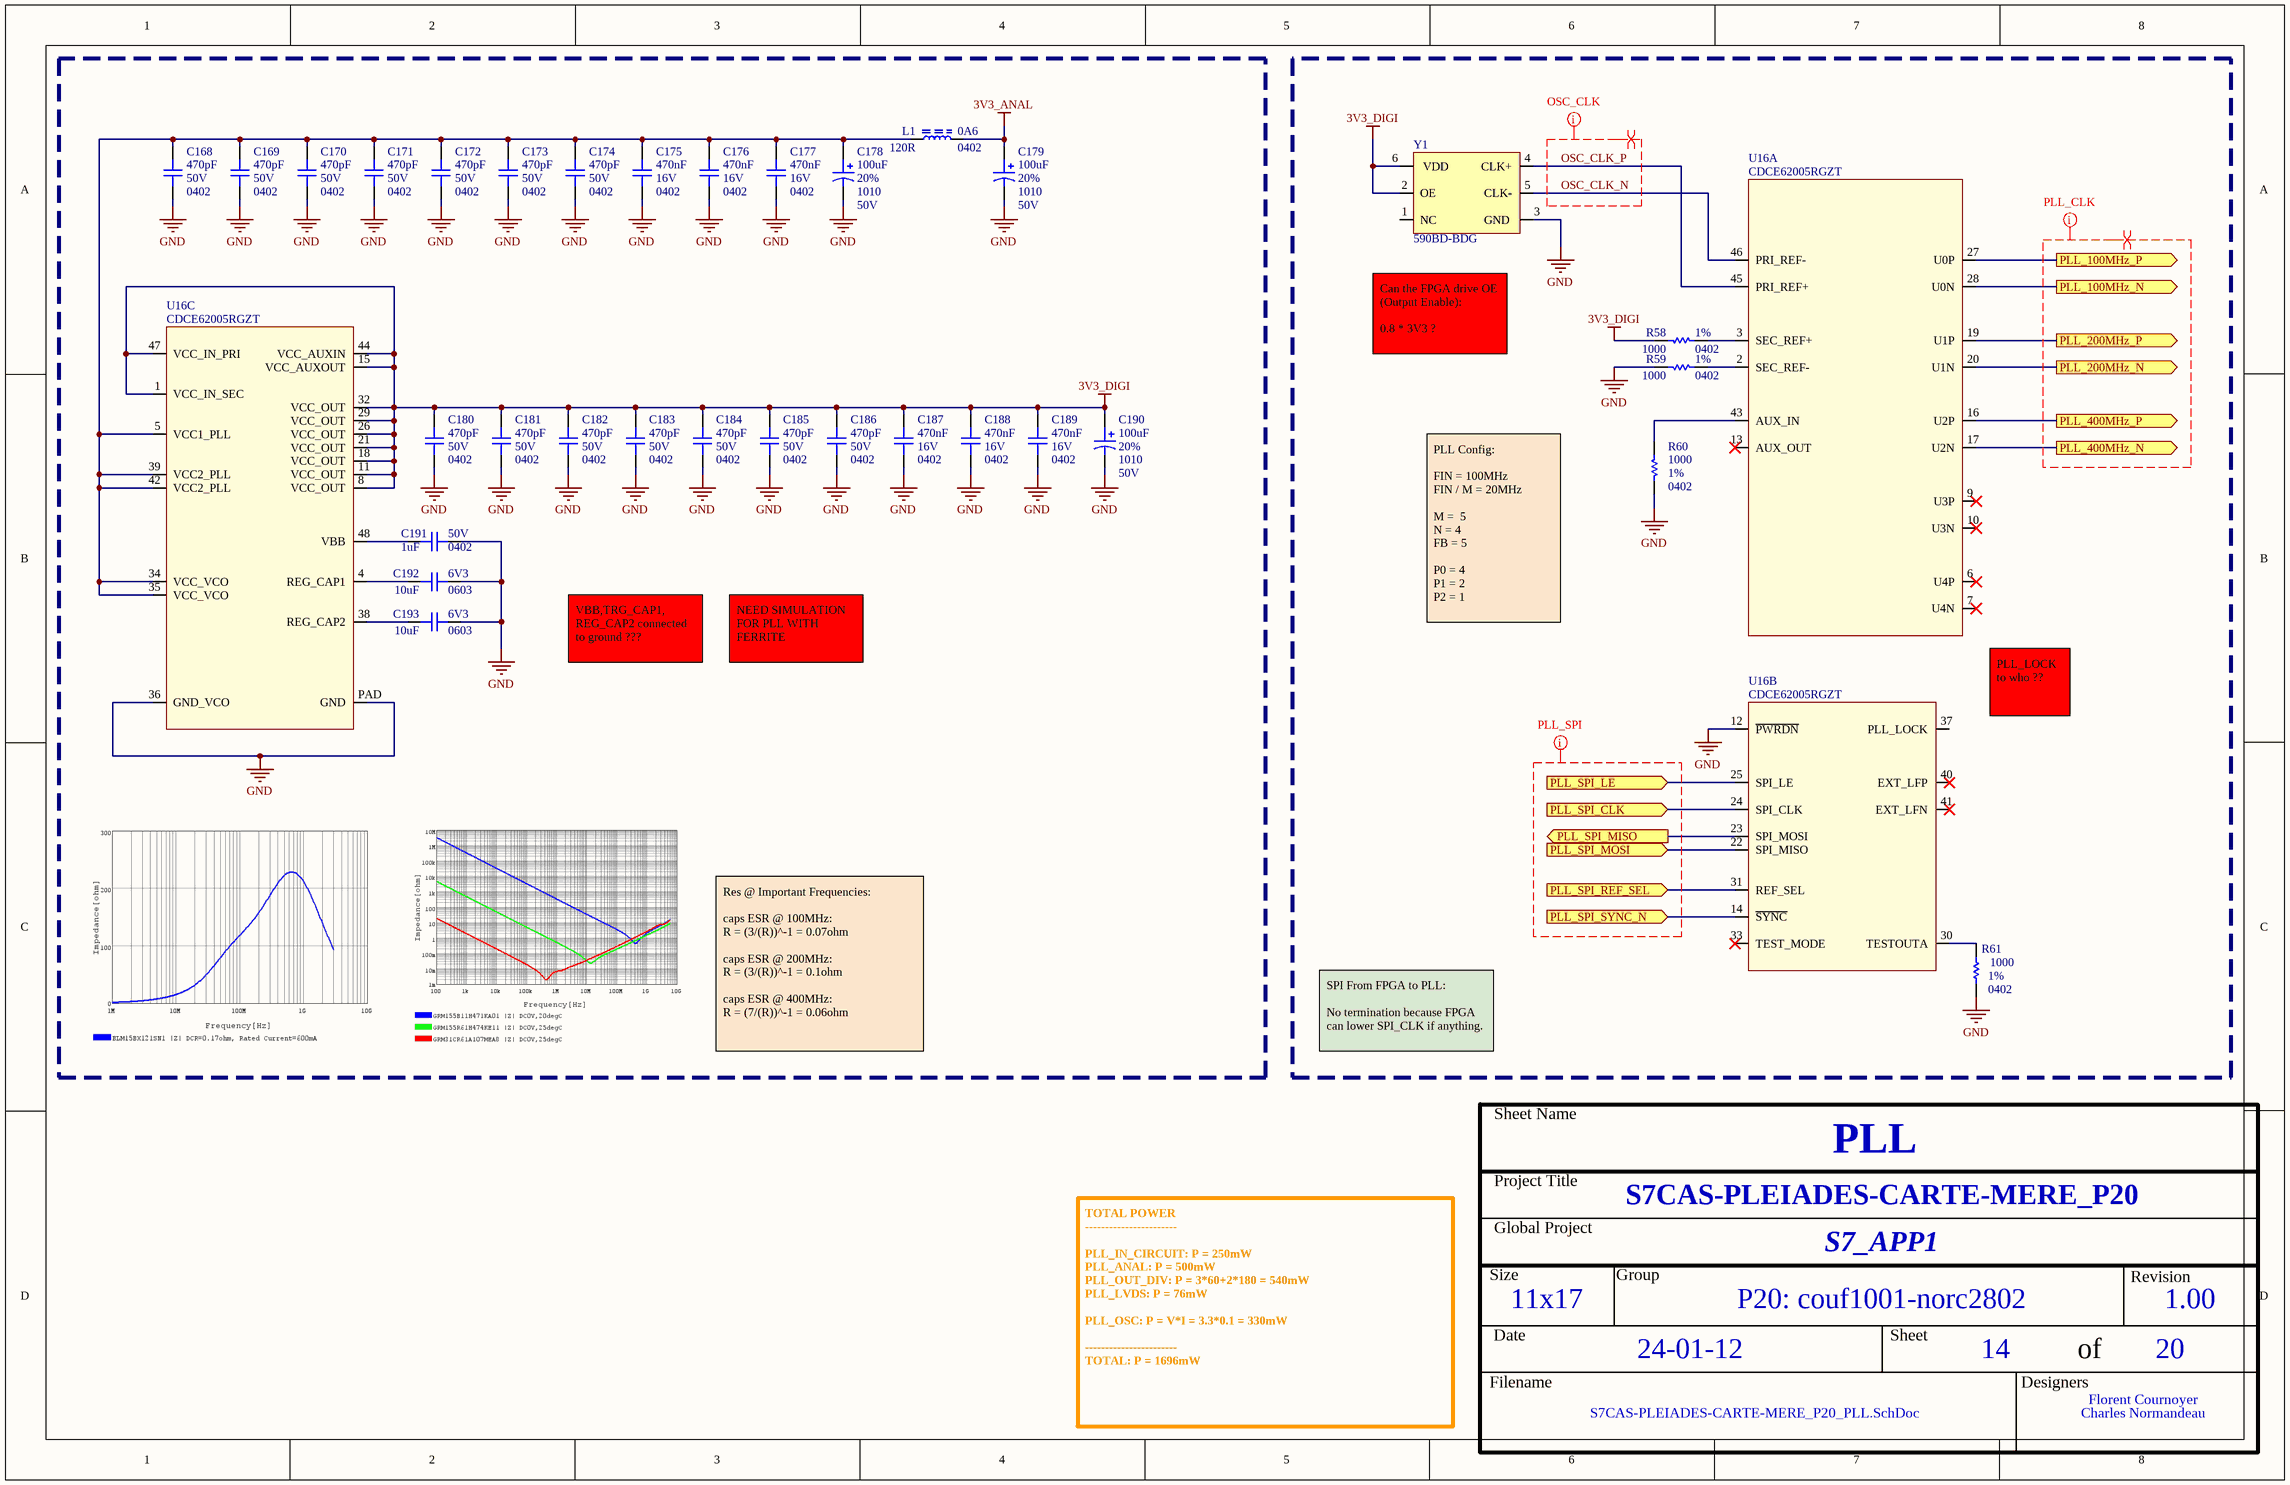
[diagram p13: S7CAS-PLEIADES-CARTE-MERE_P20_PLL.SchDoc]

### Parts
C168  value 470pF  Voltage: 50V  Package: 0402  [CAP_0402]  (hidden comment: CAP - 0402)
C169  value 470pF  Voltage: 50V  Package: 0402  [CAP_0402]  (hidden comment: CAP - 0402)
C170  value 470pF  Voltage: 50V  Package: 0402  [CAP_0402]  (hidden comment: CAP - 0402)
C171  value 470pF  Voltage: 50V  Package: 0402  [CAP_0402]  (hidden comment: CAP - 0402)
C172  value 470pF  Voltage: 50V  Package: 0402  [CAP_0402]  (hidden comment: CAP - 0402)
C173  value 470pF  Voltage: 50V  Package: 0402  [CAP_0402]  (hidden comment: CAP - 0402)
C174  value 470pF  Voltage: 50V  Package: 0402  [CAP_0402]  (hidden comment: CAP - 0402)
C175  value 470nF  Voltage: 16V  Package: 0402  [CAP_0402]  (hidden comment: CAP - 0402)
C176  value 470nF  Voltage: 16V  Package: 0402  [CAP_0402]  (hidden comment: CAP - 0402)
C177  value 470nF  Voltage: 16V  Package: 0402  [CAP_0402]  (hidden comment: CAP - 0402)
C178  value 100uF  Voltage: 50V  Package: 1010  Precision: 20%  [CAP_ALU_1010_vishay]  (hidden comment: MAL215099101E3)
C179  value 100uF  Voltage: 50V  Package: 1010  Precision: 20%  [CAP_ALU_1010_vishay]  (hidden comment: MAL215099101E3)
C180  value 470pF  Voltage: 50V  Package: 0402  [CAP_0402]  (hidden comment: CAP - 0402)
C181  value 470pF  Voltage: 50V  Package: 0402  [CAP_0402]  (hidden comment: CAP - 0402)
C182  value 470pF  Voltage: 50V  Package: 0402  [CAP_0402]  (hidden comment: CAP - 0402)
C183  value 470pF  Voltage: 50V  Package: 0402  [CAP_0402]  (hidden comment: CAP - 0402)
C184  value 470pF  Voltage: 50V  Package: 0402  [CAP_0402]  (hidden comment: CAP - 0402)
C185  value 470pF  Voltage: 50V  Package: 0402  [CAP_0402]  (hidden comment: CAP - 0402)
C186  value 470pF  Voltage: 50V  Package: 0402  [CAP_0402]  (hidden comment: CAP - 0402)
C187  value 470nF  Voltage: 16V  Package: 0402  [CAP_0402]  (hidden comment: CAP - 0402)
C188  value 470nF  Voltage: 16V  Package: 0402  [CAP_0402]  (hidden comment: CAP - 0402)
C189  value 470nF  Voltage: 16V  Package: 0402  [CAP_0402]  (hidden comment: CAP - 0402)
C190  value 100uF  Voltage: 50V  Package: 1010  Precision: 20%  [CAP_ALU_1010_vishay]  (hidden comment: MAL215099101E3)
C191  value 1uF  Voltage: 50V  Package: 0402  [CAP_0402]  (hidden comment: CAP - 0402)
C192  value 10uF  Voltage: 6V3  Package: 0603  [CAP_0603]  (hidden comment: CAP - 0603)
C193  value 10uF  Voltage: 6V3  Package: 0603  [CAP_0603]  (hidden comment: CAP - 0603)
L1  value 120R  Current: 0A6  Package: 0402  [FER_0402]  (hidden comment: FER - 0402)
R58  value 1000  Package: 0402  Precision: 1%  [RES_0402]  (hidden comment: RES - 0402)
R59  value 1000  Package: 0402  Precision: 1%  [RES_0402]  (hidden comment: RES - 0402)
R60  value 1000  Package: 0402  Precision: 1%  [RES_0402]  (hidden comment: RES - 0402)
R61  value 1000  Package: 0402  Precision: 1%  [RES_0402]  (hidden comment: RES - 0402)
U16  CDCE62005RGZT  [TIM_CDCE62005RGZT]  (parts A,B,C of 3)
Y1  590BD-BDG  [OSC_590BD-BDG]

### Ports
PLL_100MHz_N (out), PLL_100MHz_P (out), PLL_200MHz_N (out), PLL_200MHz_P (out), PLL_400MHz_N (out), PLL_400MHz_P (out), PLL_SPI_CLK (in), PLL_SPI_LE (in), PLL_SPI_MISO (out), PLL_SPI_MOSI (in), PLL_SPI_REF_SEL (in), PLL_SPI_SYNC_N (in)

### Nets
3V3_ANAL: C179.1 L1.1
3V3_DIGI: C180.2 C181.2 C182.2 C183.2 C184.2 C185.2 C186.2 C187.2 C188.2 C189.2 C190.1 R58.2 U16.1(VCC_IN_SEC) U16.8(VCC_OUT) U16.11(VCC_OUT) U16.15(VCC_AUXOUT) U16.18(VCC_OUT) U16.21(VCC_OUT) U16.26(VCC_OUT) U16.29(VCC_OUT) U16.32(VCC_OUT) U16.44(VCC_AUXIN) U16.47(VCC_IN_PRI) Y1.2(OE) Y1.6(VDD)
GND: C168.1 C169.1 C170.1 C171.1 C172.1 C173.1 C174.1 C175.1 C176.1 C177.1 C178.2 C179.2 C180.1 C181.1 C182.1 C183.1 C184.1 C185.1 C186.1 C187.1 C188.1 C189.1 C190.2 C191.1 C192.1 C193.1 R59.1 R60.2 R61.1 U16.12(~{PWRDN}) U16.36(GND_VCO) U16.PAD(GND) Y1.3(GND)
OSC_CLK_N: U16.46(PRI_REF-) Y1.5(CLK-)
OSC_CLK_P: U16.45(PRI_REF+) Y1.4(CLK+)
PLL_100MHz_N: U16.28(U0N) ; port PLL_100MHz_N
PLL_100MHz_P: U16.27(U0P) ; port PLL_100MHz_P
PLL_200MHz_N: U16.20(U1N) ; port PLL_200MHz_N
PLL_200MHz_P: U16.19(U1P) ; port PLL_200MHz_P
PLL_400MHz_N: U16.17(U2N) ; port PLL_400MHz_N
PLL_400MHz_P: U16.16(U2P) ; port PLL_400MHz_P
PLL_SPI_CLK: U16.24(SPI_CLK) ; port PLL_SPI_CLK
PLL_SPI_LE: U16.25(SPI_LE) ; port PLL_SPI_LE
PLL_SPI_MISO: U16.23(SPI_MOSI) ; port PLL_SPI_MISO
PLL_SPI_MOSI: U16.22(SPI_MISO) ; port PLL_SPI_MOSI
PLL_SPI_REF_SEL: U16.31(REF_SEL) ; port PLL_SPI_REF_SEL
PLL_SPI_SYNC_N: U16.14(~{SYNC}) ; port PLL_SPI_SYNC_N
NetC168_2: C168.2 C169.2 C170.2 C171.2 C172.2 C173.2 C174.2 C175.2 C176.2 C177.2 C178.1 L1.2 U16.5(VCC1_PLL) U16.34(VCC_VCO) U16.35(VCC_VCO) U16.39(VCC2_PLL) U16.42(VCC2_PLL)
NetC191_2: C191.2 U16.48(VBB)
NetC192_2: C192.2 U16.4(REG_CAP1)
NetC193_2: C193.2 U16.38(REG_CAP2)
NetR58_1: R58.1 U16.3(SEC_REF+)
NetR59_2: R59.2 U16.2(SEC_REF-)
NetR60_1: R60.1 U16.43(AUX_IN)
NetR61_2: R61.2 U16.30(TESTOUTA)

Not connected (* = marked no-connect by the designer): U16 6(U4P)* 7(U4N)* 9(U3P)* 10(U3N)* 13(AUX_OUT)* 33(TEST_MODE)* 37(PLL_LOCK) 40(EXT_LFP)* 41(EXT_LFN)*; Y1 1(NC)

### Layout directives
net class TRACKS_50: (no net found under the mark), OSC_CLK_N, OSC_CLK_P
differential pair: (no net found under the mark), OSC_CLK_N, OSC_CLK_P

### Notes on the sheet
- Can the FPGA drive OE (Output Enable):
  0.8 * 3V3 ?
- PLL Config:
  FIN = 100MHz
  FIN / M = 20MHz
  M =  5
  N = 4
  FB = 5
  P0 = 4
  P1 = 2
  P2 = 1
- VBB,TRG_CAP1, REG_CAP2 connected to ground ???
- NEED SIMULATION FOR PLL WITH FERRITE
- (near U16) PLL_LOCK to who ??
- Res @ Important Frequencies:
  caps ESR @ 100MHz:
  R = (3/(R))^-1 = 0.07ohm
  caps ESR @ 200MHz:
  R = (3/(R))^-1 = 0.1ohm
  caps ESR @ 400MHz:
  R = (7/(R))^-1 = 0.06ohm
- SPI From FPGA to PLL:
  No termination because FPGA can lower SPI_CLK if anything.
- TOTAL POWER
  -----------------------
  PLL_IN_CIRCUIT: P = 250mW
  PLL_ANAL: P = 500mW
  PLL_OUT_DIV: P = 3*60+2*180 = 540mW
  PLL_LVDS: P = 76mW
  PLL_OSC: P = V*I = 3.3*0.1 = 330mW
  -----------------------
  TOTAL: P = 1696mW
- Sheet Name
- Project Title
- Global Project
- Size
- Group
- Revision
- Date
- Sheet
- of
- Filename
- Designers

### Library data of the parts
C168-C174 C180-C186 = CAP - 0402: Mfg Part Number: GRM155B11H471KA01; Precision: 10%; Current: *; CreatedBy: Jonathan Bouchard; Power: *
C175-C177 C187-C189 = CAP - 0402: as C130-C139 on sheet S7CAS-PLEIADES-CARTE-MERE_P20_FPGA-Decoupling; Current: *; CreatedBy: Jonathan Bouchard; Power: *
C178 C179 C190 = CAP_ALU_MAL215099101E3: as C122-C124 on sheet S7CAS-PLEIADES-CARTE-MERE_P20_FPGA-Decoupling; Mfg Part Number: MAL215099101E3; HelpURL: http://www.vishay.com/docs/28395/150crz.pdf; CreatedBy: Jonathan Bouchard; Temperature: -55°C to 125°C; Power: *; Supplier 1: Digikey; Supplier Part Number 1: 4399PHDKR-ND
C191 = CAP - 0402: Mfg Part Number: GXT155R61E105KE01; Precision: 10%; Current: *; CreatedBy: Jonathan Bouchard; Power: *
C192 C193 = CAP - 0603: Mfg Part Number: GRM185R60J106ME15; Precision: 20%; Current: *; CreatedBy: Jonathan Bouchard; Power: *
L1 = FER - 0402: Mfg Part Number: BLM15BX121SN1; Voltage: *; CreatedBy: Jonathan Bouchard; Power: *; Precision: *
R58-R61 = RES - 0402: as R62 on sheet S7CAS-PLEIADES-CARTE-MERE_P20_Ethernet; Current: *; CreatedBy: Jonathan Bouchard
U16 = TIM_CDCE62005RGZT: TIM - CLK SYNTH JITTER CLEANER 3:5 - QFN-48; Voltage: 3 V ~ 3.6 V; Mfg: Texas Instruments; Current: *; Power: *; Mfg Part Number: CDCE62005RGZT; HelpURL: http://www.ti.com/lit/ds/symlink/cdce62005.pdf; CreatedBy: Jonathan Bouchard; Temperature: -40°C ~ 85°C; Value: *; Precision: *; Package: QFN-48; Supplier 1: Digikey; Supplier Part Number 1: 296-23947-1-ND
Y1 = OSC_590BD-BDG: TIM - OSC PROG 125MHz ~ 214.999MHz LVDS 3.3V 7PPM EN/DS - 6-SMD; Manufacturer #1: Silicon Labs; Current Rating: 100 mA (supply); Note: Spécifié la fréquence lors de la commande; Voltage rating: 3.3V (supply); Polarized: Yes; Value: ±7ppm (freq Stability), ±20ppm (freq stability total); Magnetic Material: UNKNOWN; GRAMS Lib Spec: 2.8; Manufacturer #2: *; Power Max: *; Part Number #1: 590BD-BDG; Part Number #2: *; HelpURL: https://www.silabs.com/documents/public/data-sheets/Si590-591.pdf; Supplier 1: Digi-Key; Supplier Part Number 1: 590BD-BDG-ND; Assembly Type: SMD; Temperature: -40°C ~ 85°C; Package: 6-SMD; CreatedBy/Date: from 590BD-CDG; Tolerance: *; VerifiedBy: Caroline Paulin / 3/10/2019; Cryo: UNKNOWN

## Sheet S7CAS-PLEIADES-CARTE-MERE_P20_DAC.SchDoc
size Tabloid; SheetNumber: 15; SheetTotal: 20; Sheet_Name: DAC; Size: 11x17
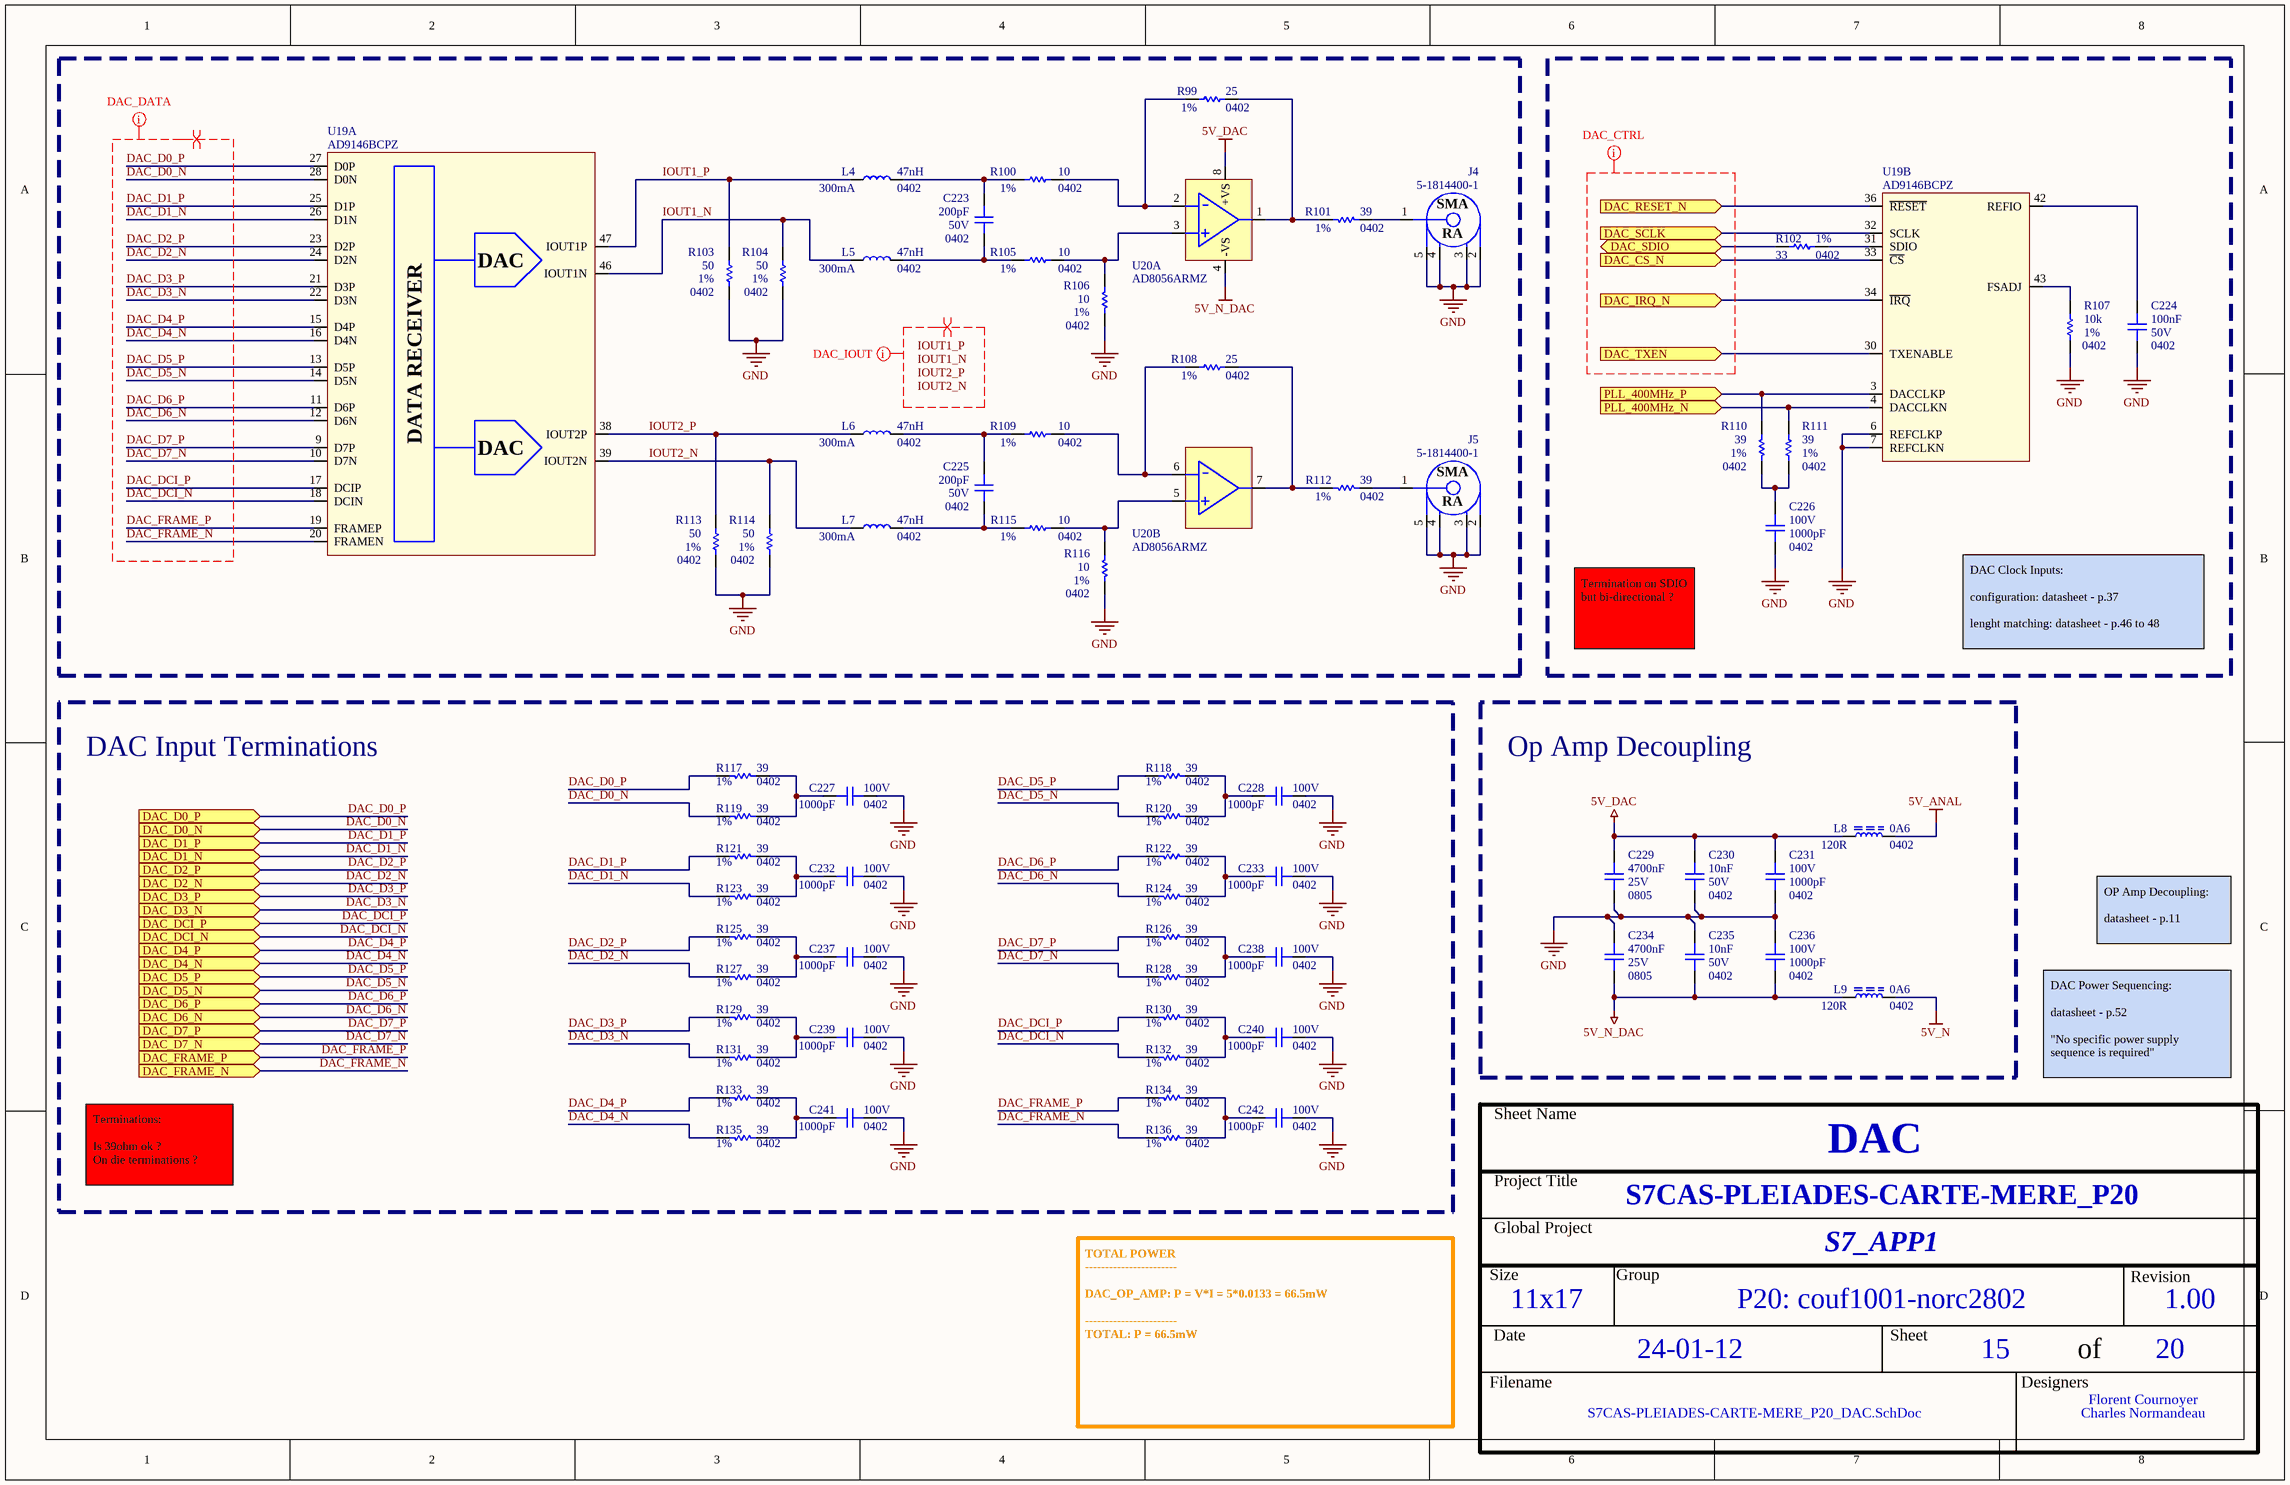
[diagram p14: S7CAS-PLEIADES-CARTE-MERE_P20_DAC.SchDoc]

### Parts
C223  value 200pF  Voltage: 50V  Package: 0402  [CAP_0402]  (hidden comment: CAP - 0402)
C224  value 100nF  Voltage: 50V  Package: 0402  [CAP_0402]  (hidden comment: CAP - 0402)
C225  value 200pF  Voltage: 50V  Package: 0402  [CAP_0402]  (hidden comment: CAP - 0402)
C226  value 1000pF  Voltage: 100V  Package: 0402  [CAP_0402]  (hidden comment: CAP - 0402)
C227  value 1000pF  Voltage: 100V  Package: 0402  [CAP_0402]  (hidden comment: CAP - 0402)
C228  value 1000pF  Voltage: 100V  Package: 0402  [CAP_0402]  (hidden comment: CAP - 0402)
C229  value 4700nF  Voltage: 25V  Package: 0805  [CAP_0805]  (hidden comment: CAP - 0805)
C230  value 10nF  Voltage: 50V  Package: 0402  [CAP_0402]  (hidden comment: CAP - 0402)
C231  value 1000pF  Voltage: 100V  Package: 0402  [CAP_0402]  (hidden comment: CAP - 0402)
C232  value 1000pF  Voltage: 100V  Package: 0402  [CAP_0402]  (hidden comment: CAP - 0402)
C233  value 1000pF  Voltage: 100V  Package: 0402  [CAP_0402]  (hidden comment: CAP - 0402)
C234  value 4700nF  Voltage: 25V  Package: 0805  [CAP_0805]  (hidden comment: CAP - 0805)
C235  value 10nF  Voltage: 50V  Package: 0402  [CAP_0402]  (hidden comment: CAP - 0402)
C236  value 1000pF  Voltage: 100V  Package: 0402  [CAP_0402]  (hidden comment: CAP - 0402)
C237  value 1000pF  Voltage: 100V  Package: 0402  [CAP_0402]  (hidden comment: CAP - 0402)
C238  value 1000pF  Voltage: 100V  Package: 0402  [CAP_0402]  (hidden comment: CAP - 0402)
C239  value 1000pF  Voltage: 100V  Package: 0402  [CAP_0402]  (hidden comment: CAP - 0402)
C240  value 1000pF  Voltage: 100V  Package: 0402  [CAP_0402]  (hidden comment: CAP - 0402)
C241  value 1000pF  Voltage: 100V  Package: 0402  [CAP_0402]  (hidden comment: CAP - 0402)
C242  value 1000pF  Voltage: 100V  Package: 0402  [CAP_0402]  (hidden comment: CAP - 0402)
J4  5-1814400-1  [CONN_SMA_5-1814400-1]
J5  5-1814400-1  [CONN_SMA_5-1814400-1]
L4  value 47nH  Current: 300mA  Package: 0402  [IND_0402]  (hidden comment: Part Number)
L5  value 47nH  Current: 300mA  Package: 0402  [IND_0402]  (hidden comment: Part Number)
L6  value 47nH  Current: 300mA  Package: 0402  [IND_0402]  (hidden comment: Part Number)
L7  value 47nH  Current: 300mA  Package: 0402  [IND_0402]  (hidden comment: Part Number)
L8  value 120R  Current: 0A6  Package: 0402  [FER_0402]  (hidden comment: FER - 0402)
L9  value 120R  Current: 0A6  Package: 0402  [FER_0402]  (hidden comment: FER - 0402)
R99  value 25  Package: 0402  Precision: 1%  [RES_0402]  (hidden comment: RES - 0402)
R100  value 10  Package: 0402  Precision: 1%  [RES_0402]  (hidden comment: RES - 0402)
R101  value 39  Package: 0402  Precision: 1%  [RES_0402]  (hidden comment: RES - 0402)
R102  value 33  Package: 0402  Precision: 1%  [RES_0402]  (hidden comment: RES - 0402)
R103  value 50  Package: 0402  Precision: 1%  [RES_0402]  (hidden comment: RES - 0402)
R104  value 50  Package: 0402  Precision: 1%  [RES_0402]  (hidden comment: RES - 0402)
R105  value 10  Package: 0402  Precision: 1%  [RES_0402]  (hidden comment: RES - 0402)
R106  value 10  Package: 0402  Precision: 1%  [RES_0402]  (hidden comment: RES - 0402)
R107  value 10k  Package: 0402  Precision: 1%  [RES_0402]  (hidden comment: RES - 0402)
R108  value 25  Package: 0402  Precision: 1%  [RES_0402]  (hidden comment: RES - 0402)
R109  value 10  Package: 0402  Precision: 1%  [RES_0402]  (hidden comment: RES - 0402)
R110  value 39  Package: 0402  Precision: 1%  [RES_0402]  (hidden comment: RES - 0402)
R111  value 39  Package: 0402  Precision: 1%  [RES_0402]  (hidden comment: RES - 0402)
R112  value 39  Package: 0402  Precision: 1%  [RES_0402]  (hidden comment: RES - 0402)
R113  value 50  Package: 0402  Precision: 1%  [RES_0402]  (hidden comment: RES - 0402)
R114  value 50  Package: 0402  Precision: 1%  [RES_0402]  (hidden comment: RES - 0402)
R115  value 10  Package: 0402  Precision: 1%  [RES_0402]  (hidden comment: RES - 0402)
R116  value 10  Package: 0402  Precision: 1%  [RES_0402]  (hidden comment: RES - 0402)
R117  value 39  Package: 0402  Precision: 1%  [RES_0402]  (hidden comment: RES - 0402)
R118  value 39  Package: 0402  Precision: 1%  [RES_0402]  (hidden comment: RES - 0402)
R119  value 39  Package: 0402  Precision: 1%  [RES_0402]  (hidden comment: RES - 0402)
R120  value 39  Package: 0402  Precision: 1%  [RES_0402]  (hidden comment: RES - 0402)
R121  value 39  Package: 0402  Precision: 1%  [RES_0402]  (hidden comment: RES - 0402)
R122  value 39  Package: 0402  Precision: 1%  [RES_0402]  (hidden comment: RES - 0402)
R123  value 39  Package: 0402  Precision: 1%  [RES_0402]  (hidden comment: RES - 0402)
R124  value 39  Package: 0402  Precision: 1%  [RES_0402]  (hidden comment: RES - 0402)
R125  value 39  Package: 0402  Precision: 1%  [RES_0402]  (hidden comment: RES - 0402)
R126  value 39  Package: 0402  Precision: 1%  [RES_0402]  (hidden comment: RES - 0402)
R127  value 39  Package: 0402  Precision: 1%  [RES_0402]  (hidden comment: RES - 0402)
R128  value 39  Package: 0402  Precision: 1%  [RES_0402]  (hidden comment: RES - 0402)
R129  value 39  Package: 0402  Precision: 1%  [RES_0402]  (hidden comment: RES - 0402)
R130  value 39  Package: 0402  Precision: 1%  [RES_0402]  (hidden comment: RES - 0402)
R131  value 39  Package: 0402  Precision: 1%  [RES_0402]  (hidden comment: RES - 0402)
R132  value 39  Package: 0402  Precision: 1%  [RES_0402]  (hidden comment: RES - 0402)
R133  value 39  Package: 0402  Precision: 1%  [RES_0402]  (hidden comment: RES - 0402)
R134  value 39  Package: 0402  Precision: 1%  [RES_0402]  (hidden comment: RES - 0402)
R135  value 39  Package: 0402  Precision: 1%  [RES_0402]  (hidden comment: RES - 0402)
R136  value 39  Package: 0402  Precision: 1%  [RES_0402]  (hidden comment: RES - 0402)
U19  AD9146BCPZ  [DAC_AD9146BCPZ]  (parts A,B of 3)
U20  AD8056ARMZ  [OPAMP_AD8056ARMZ]  (parts A,B of 2)

### Blocks framed on the sheet
DAC Input Terminations: C227 C228 C232 C233 C237-C242 R117-R136
Op Amp Decoupling: C229-C231 C234-C236 L8 L9

### Ports
DAC_CS_N (in), DAC_D0_N (in), DAC_D0_P (in), DAC_D1_N (in), DAC_D1_P (in), DAC_D2_N (in), DAC_D2_P (in), DAC_D3_N (in), DAC_D3_P (in), DAC_D4_N (in), DAC_D4_P (in), DAC_D5_N (in), DAC_D5_P (in), DAC_D6_N (in), DAC_D6_P (in), DAC_D7_N (in), DAC_D7_P (in), DAC_DCI_N (in), DAC_DCI_P (in), DAC_FRAME_N (in), DAC_FRAME_P (in), DAC_IRQ_N (in), DAC_RESET_N (in), DAC_SCLK (in), DAC_SDIO (bidir), DAC_TXEN (in), PLL_400MHz_N (in), PLL_400MHz_P (in)

### Nets
5V_ANAL: L8.1
5V_DAC: C229.2 C230.2 C231.1 L8.2 U20.8(+VS)
5V_N: L9.1
5V_N_DAC: C234.1 C235.1 C236.2 L9.2 U20.4(-VS)
GND: C224.1 C226.2 C227.1 C228.1 C229.1 C230.1 C231.2 C232.1 C233.1 C234.2 C235.2 C236.1 C237.1 C238.1 C239.1 C240.1 C241.1 C242.1 J4.2 J4.3 J4.4 J4.5 J5.2 J5.3 J5.4 J5.5 R103.2 R104.2 R106.1 R107.1 R113.2 R114.2 R116.1 U19.6(REFCLKP) U19.7(REFCLKN)
DAC_CS_N: U19.33(~{CS}) ; port DAC_CS_N
DAC_D0_N: R119.1 U19.28(D0N) ; port DAC_D0_N
DAC_D0_P: R117.1 U19.27(D0P) ; port DAC_D0_P
DAC_D1_N: R123.1 U19.26(D1N) ; port DAC_D1_N
DAC_D1_P: R121.1 U19.25(D1P) ; port DAC_D1_P
DAC_D2_N: R127.1 U19.24(D2N) ; port DAC_D2_N
DAC_D2_P: R125.1 U19.23(D2P) ; port DAC_D2_P
DAC_D3_N: R131.1 U19.22(D3N) ; port DAC_D3_N
DAC_D3_P: R129.1 U19.21(D3P) ; port DAC_D3_P
DAC_D4_N: R135.1 U19.16(D4N) ; port DAC_D4_N
DAC_D4_P: R133.1 U19.15(D4P) ; port DAC_D4_P
DAC_D5_N: R120.1 U19.14(D5N) ; port DAC_D5_N
DAC_D5_P: R118.1 U19.13(D5P) ; port DAC_D5_P
DAC_D6_N: R124.1 U19.12(D6N) ; port DAC_D6_N
DAC_D6_P: R122.1 U19.11(D6P) ; port DAC_D6_P
DAC_D7_N: R128.1 U19.10(D7N) ; port DAC_D7_N
DAC_D7_P: R126.1 U19.9(D7P) ; port DAC_D7_P
DAC_DCI_N: R132.1 U19.18(DCIN) ; port DAC_DCI_N
DAC_DCI_P: R130.1 U19.17(DCIP) ; port DAC_DCI_P
DAC_FRAME_N: R136.1 U19.20(FRAMEN) ; port DAC_FRAME_N
DAC_FRAME_P: R134.1 U19.19(FRAMEP) ; port DAC_FRAME_P
DAC_IRQ_N: U19.34(~{IRQ}) ; port DAC_IRQ_N
DAC_RESET_N: U19.36(~{RESET}) ; port DAC_RESET_N
DAC_SCLK: U19.32(SCLK) ; port DAC_SCLK
DAC_SDIO: R102.2 ; port DAC_SDIO
DAC_TXEN: U19.30(TXENABLE) ; port DAC_TXEN
IOUT1_N: L5.1 R104.1 U19.46(IOUT1N)
IOUT1_P: L4.1 R103.1 U19.47(IOUT1P)
IOUT2_N: L7.1 R114.1 U19.39(IOUT2N)
IOUT2_P: L6.1 R113.1 U19.38(IOUT2P)
PLL_400MHz_N: R111.2 U19.4(DACCLKN) ; port PLL_400MHz_N
PLL_400MHz_P: R110.2 U19.3(DACCLKP) ; port PLL_400MHz_P
NetC223_1: C223.1 L5.2 R105.2
NetC223_2: C223.2 L4.2 R100.2
NetC224_2: C224.2 U19.42(REFIO)
NetC225_1: C225.1 L7.2 R115.2
NetC225_2: C225.2 L6.2 R109.2
NetC226_1: C226.1 R110.1 R111.1
NetC227_2: C227.2 R117.2 R119.2
NetC228_2: C228.2 R118.2 R120.2
NetC232_2: C232.2 R121.2 R123.2
NetC233_2: C233.2 R122.2 R124.2
NetC237_2: C237.2 R125.2 R127.2
NetC238_2: C238.2 R126.2 R128.2
NetC239_2: C239.2 R129.2 R131.2
NetC240_2: C240.2 R130.2 R132.2
NetC241_2: C241.2 R133.2 R135.2
NetC242_2: C242.2 R134.2 R136.2
NetJ4_1: J4.1 R101.2
NetJ5_1: J5.1 R112.2
NetR99_1: R99.1 R101.1 U20.1(OUT1)
NetR99_2: R99.2 R100.1 U20.2(-IN1)
NetR102_1: R102.1 U19.31(SDIO)
NetR105_1: R105.1 R106.2 U20.3(+IN1)
NetR107_2: R107.2 U19.43(FSADJ)
NetR108_1: R108.1 R112.1 U20.7(OUT2)
NetR108_2: R108.2 R109.1 U20.6(-IN2)
NetR115_1: R115.1 R116.2 U20.5(+IN2)

### Layout directives
net class TRACKS_50: (no net found under the mark), DAC_D0_N, DAC_D0_P, DAC_D1_N, DAC_D1_P, DAC_D2_N, DAC_D2_P, DAC_D3_N, DAC_D3_P, DAC_D4_N, DAC_D4_P, DAC_D5_N, DAC_D5_P, DAC_D6_N, DAC_D6_P, DAC_D7_N, DAC_D7_P, DAC_DCI_N, DAC_DCI_P, DAC_FRAME_N, DAC_FRAME_P, IOUT1_N, IOUT1_P, IOUT2_N, IOUT2_P
differential pair: DAC_D0_N, DAC_D0_P, DAC_D1_N, DAC_D1_P, DAC_D2_N, DAC_D2_P, DAC_D3_N, DAC_D3_P, DAC_D4_N, DAC_D4_P, DAC_D5_N, DAC_D5_P, DAC_D6_N, DAC_D6_P, DAC_D7_N, DAC_D7_P, DAC_DCI_N, DAC_DCI_P, DAC_FRAME_N, DAC_FRAME_P, IOUT1_N, IOUT1_P, IOUT2_N, IOUT2_P

### Notes on the sheet
- Termination on SDIO but bi-directional ?
- DAC Clock Inputs:
  configuration: datasheet - p.37
  lenght matching: datasheet - p.46 to 48
- OP Amp Decoupling:
  datasheet - p.11
- DAC Power Sequencing:
  datasheet - p.52
  "No specific power supply sequence is required"
- Terminations:
  Is 39ohm ok ?
  On die terminations ?
- TOTAL POWER
  -----------------------
  DAC_OP_AMP: P = V*I = 5*0.0133 = 66.5mW
  -----------------------
  TOTAL: P = 66.5mW
- Labels drawn without touching a wire or pin: IOUT1_N, IOUT1_P, IOUT2_N, IOUT2_P
- Sheet Name
- Project Title
- Global Project
- Size
- Group
- Revision
- Date
- Sheet
- of
- Filename
- Designers
- (in symbol CONN_SMA_5-1814400-1) SMA; RA
- (in symbol DAC_AD9146BCPZ, part A) DAC; DATA RECEIVER

### Library data of the parts
C223 C225 = CAP - 0402: Mfg Part Number: GCM1555G1H201GA16; Precision: 10%; Current: *; CreatedBy: Jonathan Bouchard; Power: *
C224 = CAP - 0402: Mfg Part Number: GRM155R61H104KE14; Precision: 10%; Current: *; CreatedBy: Jonathan Bouchard; Power: *
C226-C228 C231-C233 C236-C242 = CAP - 0402: Mfg Part Number: GRM155R72A102KA01; Precision: 10%; Current: *; CreatedBy: Jonathan Bouchard; Power: *
C229 C234 = CAP - 0805: Mfg Part Number: GRM219R61E475KA73; Precision: 10%; Current: *; CreatedBy: Jonathan Bouchard; Power: *
C230 C235 = CAP - 0402: Mfg Part Number: GCM155R71H103KA55; Precision: 10%; Current: *; CreatedBy: Jonathan Bouchard; Power: *
J4 J5 = CONN_SMA_5-1814400-1: CONN -  SMA JACK R/A 50 OHM - TH; Mfg: TE Connectivity AMP Connectors; Voltage: *; Current: *; Power: *; Mfg Part Number: 5-1814400-1; HelpURL: http://www.te.com/commerce/DocumentDelivery/DDEController?Action=srchrtrv&DocNm=1814400&DocType=Customer+Drawing&DocLang=English; CreatedBy: Jonathan Bouchard; Temperature: -55°C ~ 85°C; Value: *; Precision: *; Package: TH-5; Supplier 1: Digikey; Supplier Part Number 1: A97593-ND
L4-L7 = IND - 0402: Mfg Part Number: TBD; Voltage: *
L8 L9 = FER - 0402: Mfg Part Number: BLM15BX121SN1; Voltage: *; CreatedBy: Jonathan Bouchard; Power: *; Precision: *
R99 R108 = RES - 0402: Mfg Part Number: CH0402-25RJFT; Voltage: 50V; Power: 1/16W; Current: *; CreatedBy: Jonathan Bouchard
R100 R105 R106 R109 R115 R116 = RES - 0402: Mfg Part Number: RN73H1ETTP10R1F50; Voltage: 50V; Power: 1/16W; Current: *; CreatedBy: Jonathan Bouchard
R101 R110-R112 R117-R136 = RES - 0402: Mfg Part Number: RL0510S-390-F; Voltage: 50; Power: 1/16W; Current: *; CreatedBy: Jonathan Bouchard
R102 = RES - 0402: Mfg Part Number: CRCW040233R0FKEDC; Voltage: 50V; Power: 1/16W; Current: *; CreatedBy: Jonathan Bouchard
R103 R104 R113 R114 = RES - 0402: Mfg Part Number: MIC5000BFLMGNHWS; Power: 1/8W; Voltage: 50; Current: *; CreatedBy: Jonathan Bouchard
R107 = RES - 0402: Mfg Part Number: MCS04020C1002FE000; Voltage: 50V; Power: 1/16W; Current: *; CreatedBy: Jonathan Bouchard
U19 = DAC_AD9146BCPZ: DAC - 16BIT SRL HIGH SPEED - QFN-48; Voltage: 3.13 V ~ 3.47 V / 1.71 V ~ 1.89 V; Mfg: Analog Devices Inc.; Current: *; Power: *; Mfg Part Number: AD9146BCPZ; HelpURL: http://www.analog.com/media/en/technical-documentation/data-sheets/AD9146.PDF; CreatedBy: Jonathan Bouchard; Temperature: -40°C ~ 85°C; Value: *; Precision: 16 Bit; Package: QFN-48; Supplier 1: Digikey; Supplier Part Number 1: AD9146BCPZ-ND
U20 = OPAMP_AD8056ARMZ: OPAMP - VFB 300MHZ - 8MSOP; Voltage: 8 V ~ 12 V, ±4 V ~ 6 V; Current: 60mA; Mfg: Analog Devices; Power: *; Mfg Part Number: AD8056ARMZ; HelpURL: http://www.analog.com/media/en/technical-documentation/data-sheets/AD8055_8056.pdf; CreatedBy: Jonathan Bouchard; Temperature: -40°C ~ 125°C; Value: *; Precision: *; Package: MSOP-8; Supplier 1: Digikey; Supplier Part Number 1: AD8056ARMZ-REEL7CT-ND